# EAGLE design untitled (EAGLE 9.5.2)
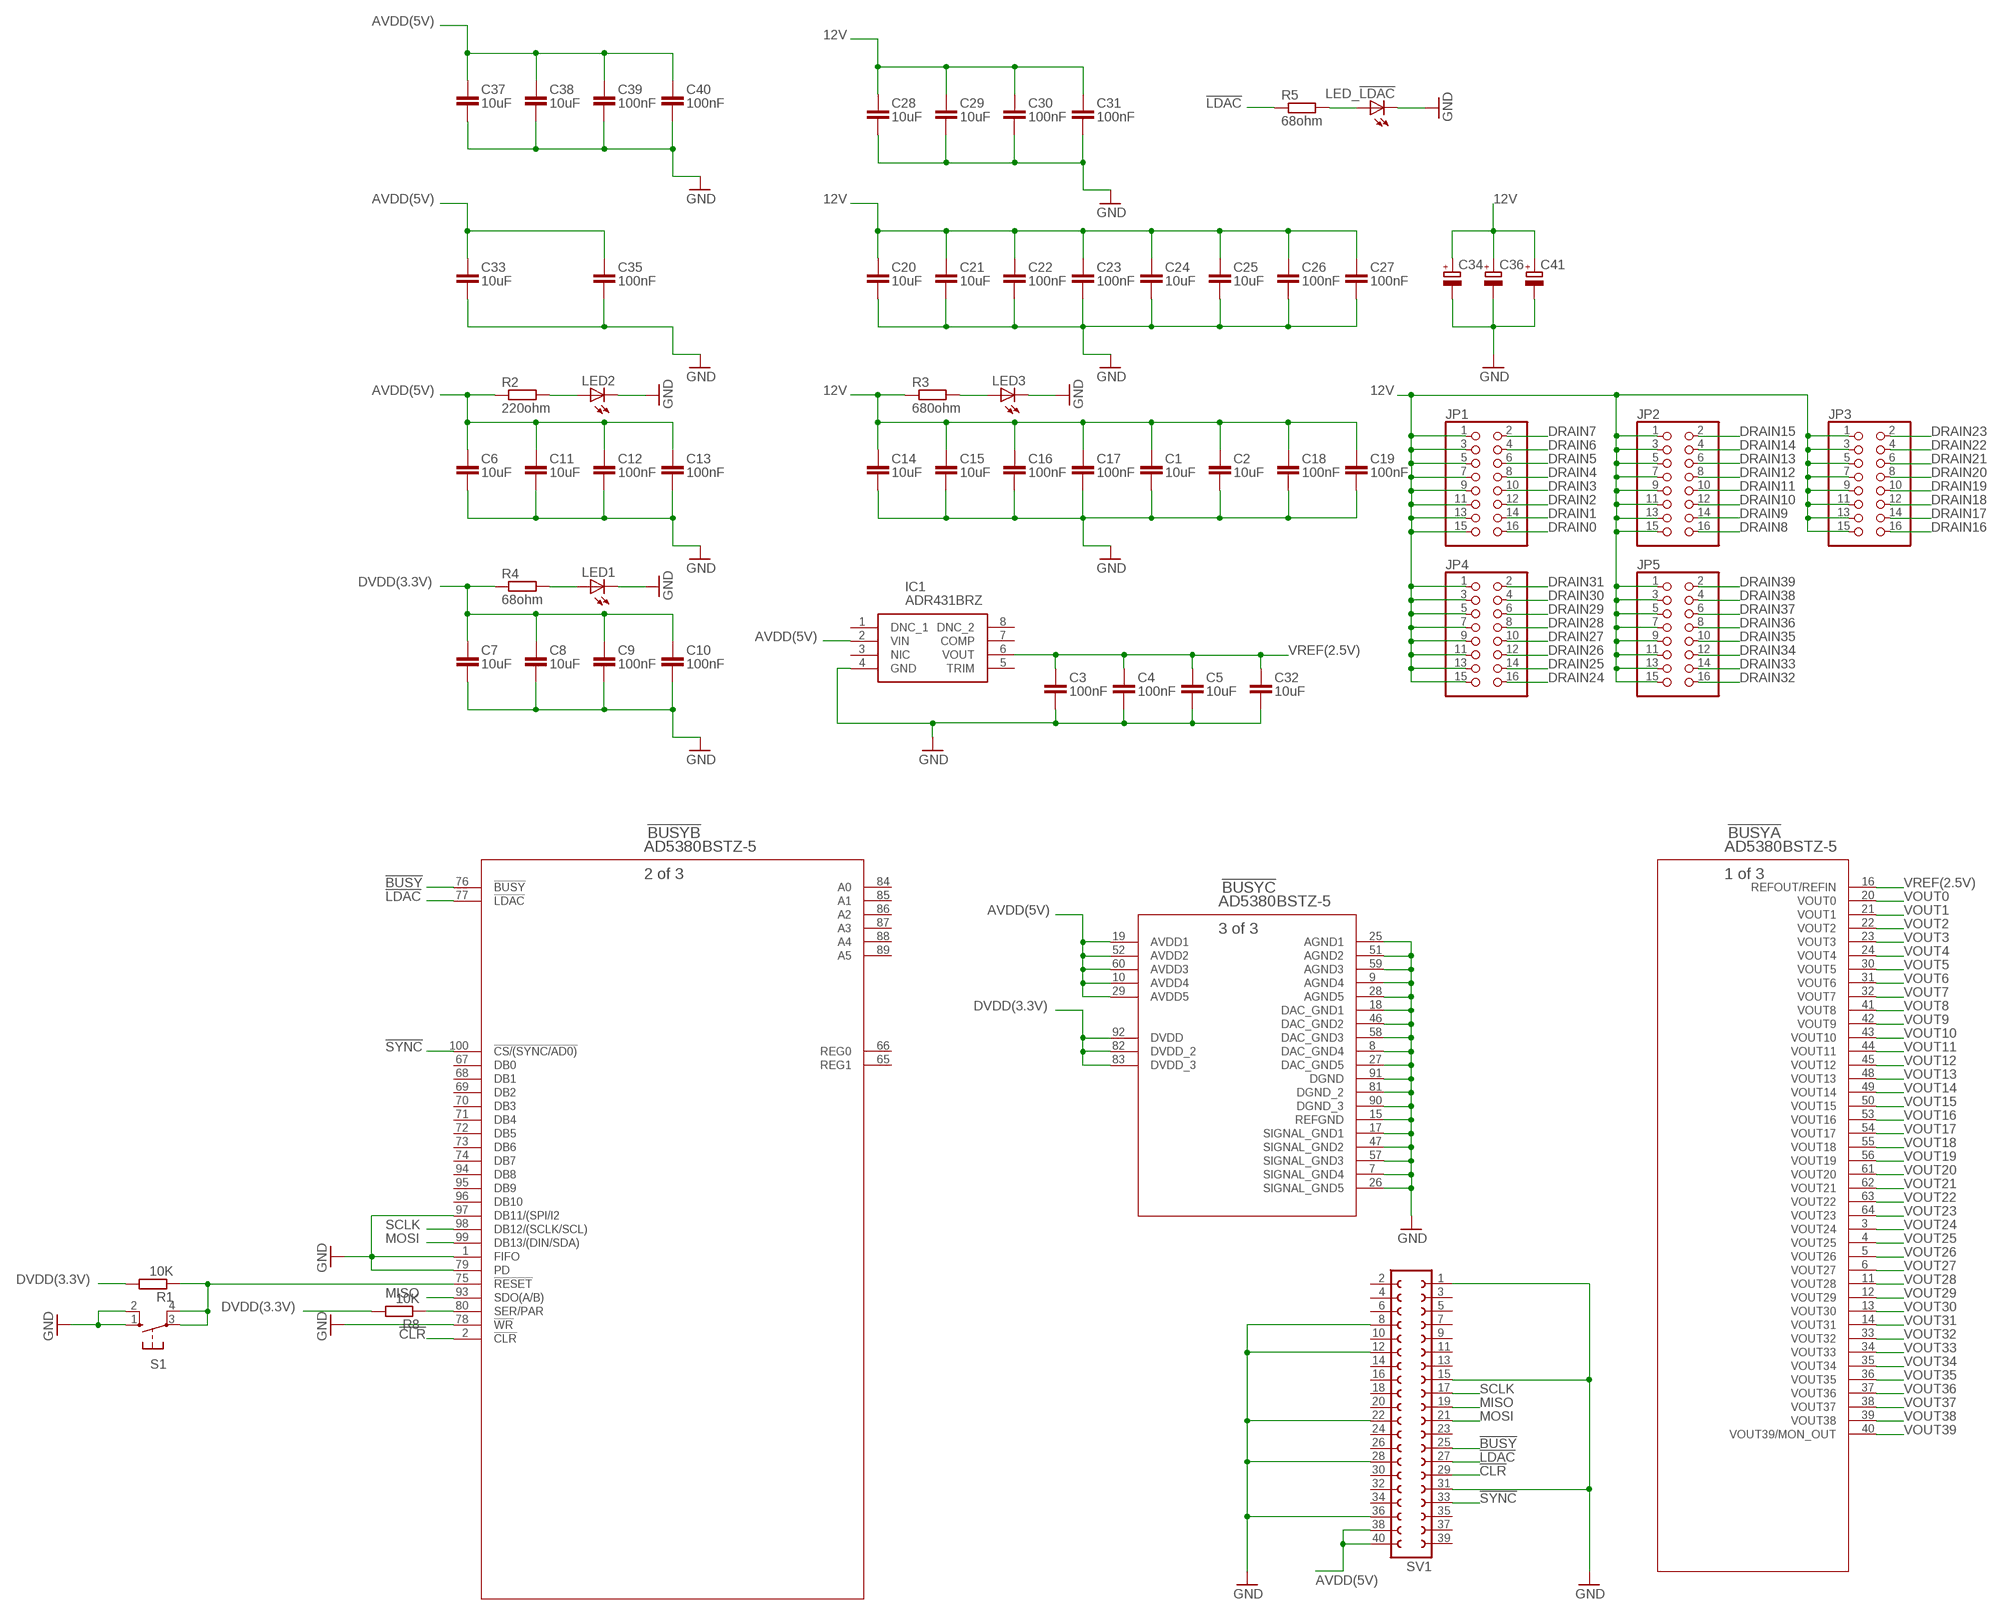
[diagram p0: schematic, sheet 1, part 1 of 2]
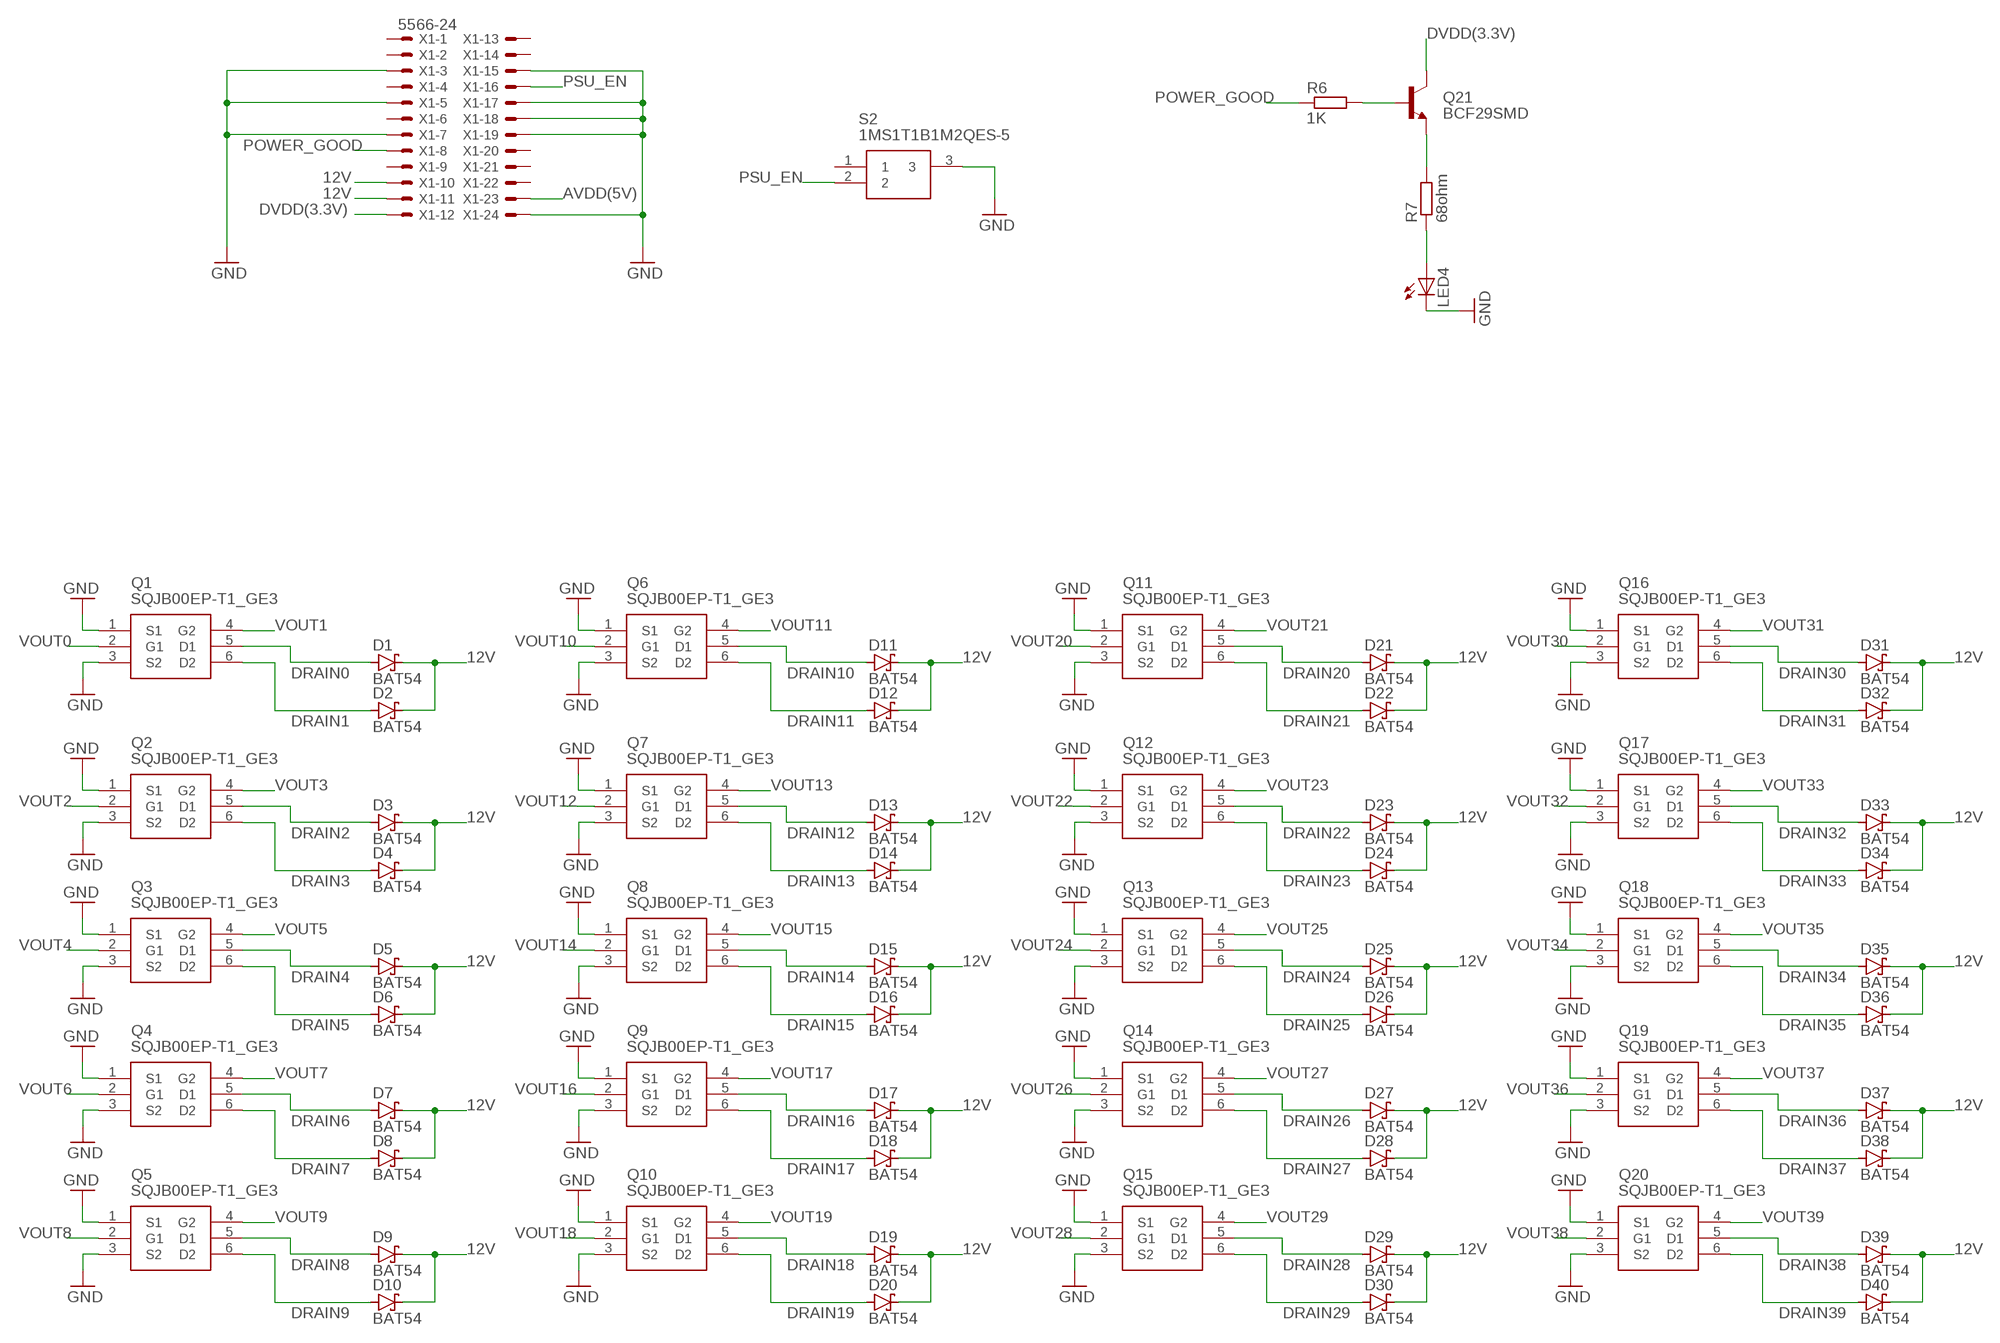
[diagram p1: schematic, sheet 1, part 2 of 2]

## Parts
!BUSY  AD5380BSTZ-5  [ST_100_1]
C1  10uF  C-EUC1206  [C1206]
C2  10uF  C-EUC1206  [C1206]
C3  100nF  C-EUC0603  [C0603]
C4  100nF  C-EUC0603  [C0603]
C5  10uF  C-EUC1206  [C1206]
C6  10uF  C-EUC1206  [C1206]
C7  10uF  C-EUC1206  [C1206]
C8  10uF  C-EUC1206  [C1206]
C9  100nF  C-EUC0603  [C0603]
C10  100nF  C-EUC0603  [C0603]
C11  10uF  C-EUC1206  [C1206]
C12  100nF  C-EUC0603  [C0603]
C13  100nF  C-EUC0603  [C0603]
C14  10uF  C-EUC1206  [C1206]
C15  10uF  C-EUC1206  [C1206]
C16  100nF  C-EUC0603  [C0603]
C17  100nF  C-EUC0603  [C0603]
C18  100nF  C-EUC0603  [C0603]
C19  100nF  C-EUC0603  [C0603]
C20  10uF  C-EUC1206  [C1206]
C21  10uF  C-EUC1206  [C1206]
C22  100nF  C-EUC0603  [C0603]
C23  100nF  C-EUC0603  [C0603]
C24  10uF  C-EUC1206  [C1206]
C25  10uF  C-EUC1206  [C1206]
C26  100nF  C-EUC0603  [C0603]
C27  100nF  C-EUC0603  [C0603]
C28  10uF  C-EUC1206  [C1206]
C29  10uF  C-EUC1206  [C1206]
C30  100nF  C-EUC0603  [C0603]
C31  100nF  C-EUC0603  [C0603]
C32  10uF  C-EUC1206  [C1206]
C33  10uF  C-EUC1206  [C1206]
C34  CPOL-EUE2-4  [E2-4]
C35  100nF  C-EUC0603  [C0603]
C36  CPOL-EUE2-4  [E2-4]
C37  10uF  C-EUC1206  [C1206]
C38  10uF  C-EUC1206  [C1206]
C39  100nF  C-EUC0603  [C0603]
C40  100nF  C-EUC0603  [C0603]
C41  CPOL-EUE3.5-10  [E3,5-10]
D1  BAT54  [SOT23]
D2  BAT54  [SOT23]
D3  BAT54  [SOT23]
D4  BAT54  [SOT23]
D5  BAT54  [SOT23]
D6  BAT54  [SOT23]
D7  BAT54  [SOT23]
D8  BAT54  [SOT23]
D9  BAT54  [SOT23]
D10  BAT54  [SOT23]
D11  BAT54  [SOT23]
D12  BAT54  [SOT23]
D13  BAT54  [SOT23]
D14  BAT54  [SOT23]
D15  BAT54  [SOT23]
D16  BAT54  [SOT23]
D17  BAT54  [SOT23]
D18  BAT54  [SOT23]
D19  BAT54  [SOT23]
D20  BAT54  [SOT23]
D21  BAT54  [SOT23]
D22  BAT54  [SOT23]
D23  BAT54  [SOT23]
D24  BAT54  [SOT23]
D25  BAT54  [SOT23]
D26  BAT54  [SOT23]
D27  BAT54  [SOT23]
D28  BAT54  [SOT23]
D29  BAT54  [SOT23]
D30  BAT54  [SOT23]
D31  BAT54  [SOT23]
D32  BAT54  [SOT23]
D33  BAT54  [SOT23]
D34  BAT54  [SOT23]
D35  BAT54  [SOT23]
D36  BAT54  [SOT23]
D37  BAT54  [SOT23]
D38  BAT54  [SOT23]
D39  BAT54  [SOT23]
D40  BAT54  [SOT23]
IC1  ADR431BRZ  [SOIC127P600X175-8N]
JP1  PINHD-2X8  [2X08]
JP2  PINHD-2X8  [2X08]
JP3  PINHD-2X8  [2X08]
JP4  PINHD-2X8  [2X08]
JP5  PINHD-2X8  [2X08]
LED1  LEDCHIPLED_0603  [CHIPLED_0603]
LED2  LEDCHIPLED_0603  [CHIPLED_0603]
LED3  LEDCHIPLED_0603  [CHIPLED_0603]
LED4  LEDCHIPLED_0603  [CHIPLED_0603]
LED_!LDAC  LEDCHIPLED_0603  [CHIPLED_0603]
Q1  SQJB00EP-T1_GE3  [SQJ968EPT1GE3]
Q2  SQJB00EP-T1_GE3  [SQJ968EPT1GE3]
Q3  SQJB00EP-T1_GE3  [SQJ968EPT1GE3]
Q4  SQJB00EP-T1_GE3  [SQJ968EPT1GE3]
Q5  SQJB00EP-T1_GE3  [SQJ968EPT1GE3]
Q6  SQJB00EP-T1_GE3  [SQJ968EPT1GE3]
Q7  SQJB00EP-T1_GE3  [SQJ968EPT1GE3]
Q8  SQJB00EP-T1_GE3  [SQJ968EPT1GE3]
Q9  SQJB00EP-T1_GE3  [SQJ968EPT1GE3]
Q10  SQJB00EP-T1_GE3  [SQJ968EPT1GE3]
Q11  SQJB00EP-T1_GE3  [SQJ968EPT1GE3]
Q12  SQJB00EP-T1_GE3  [SQJ968EPT1GE3]
Q13  SQJB00EP-T1_GE3  [SQJ968EPT1GE3]
Q14  SQJB00EP-T1_GE3  [SQJ968EPT1GE3]
Q15  SQJB00EP-T1_GE3  [SQJ968EPT1GE3]
Q16  SQJB00EP-T1_GE3  [SQJ968EPT1GE3]
Q17  SQJB00EP-T1_GE3  [SQJ968EPT1GE3]
Q18  SQJB00EP-T1_GE3  [SQJ968EPT1GE3]
Q19  SQJB00EP-T1_GE3  [SQJ968EPT1GE3]
Q20  SQJB00EP-T1_GE3  [SQJ968EPT1GE3]
Q21  BCF29SMD  [SOT23-BEC]
R1  10K  R-EU_R0603  [R0603]
R2  220ohm  R-EU_R0805  [R0805]
R3  680ohm  R-EU_R0805  [R0805]
R4  68ohm  R-EU_R0805  [R0805]
R5  68ohm  R-EU_R0805  [R0805]
R6  1K  R-EU_R0805  [R0805]
R7  68ohm  R-EU_R0805  [R0805]
R8  10K  R-EU_R0603  [R0603]
S1  10-XX  [B3F-10XX]
S2  1MS1T1B1M2QES-5  [1MS1T1B1M2QES-5]
SV1  FE20-2  [FE20-2]
X1  5566-24  [5566-24]

## Nets
12V: C1.1 C2.1 C14.1 C15.1 C16.1 C17.1 C18.1 C19.1 C20.1 C21.1 C22.1 C23.1 C24.1 C25.1 C26.1 C27.1 C28.1 C29.1 C30.1 C31.1 C34.+ C36.+ C41.+ D1.3(C) D2.3(C) D3.3(C) D4.3(C) D5.3(C) D6.3(C) D7.3(C) D8.3(C) D9.3(C) D10.3(C) D11.3(C) D12.3(C) D13.3(C) D14.3(C) D15.3(C) D16.3(C) D17.3(C) D18.3(C) D19.3(C) D20.3(C) D21.3(C) D22.3(C) D23.3(C) D24.3(C) D25.3(C) D26.3(C) D27.3(C) D28.3(C) D29.3(C) D30.3(C) D31.3(C) D32.3(C) D33.3(C) D34.3(C) D35.3(C) D36.3(C) D37.3(C) D38.3(C) D39.3(C) D40.3(C) JP1.1 JP1.3 JP1.5 JP1.7 JP1.9 JP1.11 JP1.13 JP1.15 JP2.1 JP2.3 JP2.5 JP2.7 JP2.9 JP2.11 JP2.13 JP2.15 JP3.1 JP3.3 JP3.5 JP3.7 JP3.9 JP3.11 JP3.13 JP3.15 JP4.1 JP4.3 JP4.5 JP4.7 JP4.9 JP4.11 JP4.13 JP4.15 JP5.1 JP5.3 JP5.5 JP5.7 JP5.9 JP5.11 JP5.13 JP5.15 R3.1 X1.10 X1.11
!BUSY: !BUSY.76(B:!BUSY) SV1.25
!CLR: !BUSY.2(B:!CLR) SV1.29
!LDAC: !BUSY.77(B:!LDAC) R5.1 SV1.27
!RESET: !BUSY.75(B:!RESET) R1.1 S1.3(P) S1.4(P1)
!SYNC: !BUSY.100(B:!CS/(SYNC/AD0)) SV1.33
AVDD(5V): !BUSY.10(C:AVDD4) !BUSY.19(C:AVDD1) !BUSY.29(C:AVDD5) !BUSY.52(C:AVDD2) !BUSY.60(C:AVDD3) C6.1 C11.1 C12.1 C13.1 C33.1 C35.1 C37.1 C38.1 C39.1 C40.1 IC1.2(VIN) R2.1 SV1.38 SV1.40 X1.23
DRAIN0: D1.1(A) JP1.16 Q1.5(D1)
DRAIN1: D2.1(A) JP1.14 Q1.6(D2)
DRAIN2: D3.1(A) JP1.12 Q2.5(D1)
DRAIN3: D4.1(A) JP1.10 Q2.6(D2)
DRAIN4: D5.1(A) JP1.8 Q3.5(D1)
DRAIN5: D6.1(A) JP1.6 Q3.6(D2)
DRAIN6: D7.1(A) JP1.4 Q4.5(D1)
DRAIN7: D8.1(A) JP1.2 Q4.6(D2)
DRAIN8: D9.1(A) JP2.16 Q5.5(D1)
DRAIN9: D10.1(A) JP2.14 Q5.6(D2)
DRAIN10: D11.1(A) JP2.12 Q6.5(D1)
DRAIN11: D12.1(A) JP2.10 Q6.6(D2)
DRAIN12: D13.1(A) JP2.8 Q7.5(D1)
DRAIN13: D14.1(A) JP2.6 Q7.6(D2)
DRAIN14: D15.1(A) JP2.4 Q8.5(D1)
DRAIN15: D16.1(A) JP2.2 Q8.6(D2)
DRAIN16: D17.1(A) JP3.16 Q9.5(D1)
DRAIN17: D18.1(A) JP3.14 Q9.6(D2)
DRAIN18: D19.1(A) JP3.12 Q10.5(D1)
DRAIN19: D20.1(A) JP3.10 Q10.6(D2)
DRAIN20: D21.1(A) JP3.8 Q11.5(D1)
DRAIN21: D22.1(A) JP3.6 Q11.6(D2)
DRAIN22: D23.1(A) JP3.4 Q12.5(D1)
DRAIN23: D24.1(A) JP3.2 Q12.6(D2)
DRAIN24: D25.1(A) JP4.16 Q13.5(D1)
DRAIN25: D26.1(A) JP4.14 Q13.6(D2)
DRAIN26: D27.1(A) JP4.12 Q14.5(D1)
DRAIN27: D28.1(A) JP4.10 Q14.6(D2)
DRAIN28: D29.1(A) JP4.8 Q15.5(D1)
DRAIN29: D30.1(A) JP4.6 Q15.6(D2)
DRAIN30: D31.1(A) JP4.4 Q16.5(D1)
DRAIN31: D32.1(A) JP4.2 Q16.6(D2)
DRAIN32: D33.1(A) JP5.16 Q17.5(D1)
DRAIN33: D34.1(A) JP5.14 Q17.6(D2)
DRAIN34: D35.1(A) JP5.12 Q18.5(D1)
DRAIN35: D36.1(A) JP5.10 Q18.6(D2)
DRAIN36: D37.1(A) JP5.8 Q19.5(D1)
DRAIN37: D38.1(A) JP5.6 Q19.6(D2)
DRAIN38: D39.1(A) JP5.4 Q20.5(D1)
DRAIN39: D40.1(A) JP5.2 Q20.6(D2)
DVDD(3.3V): !BUSY.82(C:DVDD_2) !BUSY.83(C:DVDD_3) !BUSY.92(C:DVDD) C7.1 C8.1 C9.1 C10.1 Q21.C R1.2 R4.1 R8.2 X1.12
GND: !BUSY.1(B:FIFO) !BUSY.7(C:SIGNAL_GND4) !BUSY.8(C:DAC_GND4) !BUSY.9(C:AGND4) !BUSY.15(C:REFGND) !BUSY.17(C:SIGNAL_GND1) !BUSY.18(C:DAC_GND1) !BUSY.25(C:AGND1) !BUSY.26(C:SIGNAL_GND5) !BUSY.27(C:DAC_GND5) !BUSY.28(C:AGND5) !BUSY.46(C:DAC_GND2) !BUSY.47(C:SIGNAL_GND2) !BUSY.51(C:AGND2) !BUSY.57(C:SIGNAL_GND3) !BUSY.58(C:DAC_GND3) !BUSY.59(C:AGND3) !BUSY.78(B:!WR) !BUSY.79(B:PD) !BUSY.81(C:DGND_2) !BUSY.90(C:DGND_3) !BUSY.91(C:DGND) !BUSY.97(B:DB11/(SPI/I2) C1.2 C2.2 C3.2 C4.2 C5.2 C6.2 C7.2 C8.2 C9.2 C10.2 C11.2 C12.2 C13.2 C14.2 C15.2 C16.2 C17.2 C18.2 C19.2 C20.2 C21.2 C22.2 C23.2 C24.2 C25.2 C26.2 C27.2 C28.2 C29.2 C30.2 C31.2 C32.2 C33.2 C34.- C35.2 C36.- C37.2 C38.2 C39.2 C40.2 C41.- IC1.4(GND) LED1.C LED2.C LED3.C LED4.C LED_!LDAC.C Q1.1(S1) Q1.3(S2) Q2.1(S1) Q2.3(S2) Q3.1(S1) Q3.3(S2) Q4.1(S1) Q4.3(S2) Q5.1(S1) Q5.3(S2) Q6.1(S1) Q6.3(S2) Q7.1(S1) Q7.3(S2) Q8.1(S1) Q8.3(S2) Q9.1(S1) Q9.3(S2) Q10.1(S1) Q10.3(S2) Q11.1(S1) Q11.3(S2) Q12.1(S1) Q12.3(S2) Q13.1(S1) Q13.3(S2) Q14.1(S1) Q14.3(S2) Q15.1(S1) Q15.3(S2) Q16.1(S1) Q16.3(S2) Q17.1(S1) Q17.3(S2) Q18.1(S1) Q18.3(S2) Q19.1(S1) Q19.3(S2) Q20.1(S1) Q20.3(S2) S1.1(S) S1.2(S1) S2.3 SV1.1 SV1.8 SV1.12 SV1.15 SV1.22 SV1.28 SV1.31 SV1.36 X1.3 X1.5 X1.7 X1.15 X1.17 X1.18 X1.19 X1.24
MISO: !BUSY.93(B:SDO(A/B)) SV1.19
MOSI: !BUSY.99(B:DB13/(DIN/SDA)) SV1.21
N$1: LED2.A R2.2
N$3: LED1.A R4.2
N$4: LED3.A R3.2
N$5: LED_!LDAC.A R5.2
N$6: Q21.B R6.2
N$7: Q21.E R7.2
N$8: LED4.A R7.1
POWER_GOOD: R6.1 X1.8
PSU_EN: S2.2 X1.16
SCLK: !BUSY.98(B:DB12/(SCLK/SCL)) SV1.17
SER/PAR: !BUSY.80(B:SER/PAR) R8.1
VOUT0: !BUSY.20(A:VOUT0) Q1.2(G1)
VOUT1: !BUSY.21(A:VOUT1) Q1.4(G2)
VOUT2: !BUSY.22(A:VOUT2) Q2.2(G1)
VOUT3: !BUSY.23(A:VOUT3) Q2.4(G2)
VOUT4: !BUSY.24(A:VOUT4) Q3.2(G1)
VOUT5: !BUSY.30(A:VOUT5) Q3.4(G2)
VOUT6: !BUSY.31(A:VOUT6) Q4.2(G1)
VOUT7: !BUSY.32(A:VOUT7) Q4.4(G2)
VOUT8: !BUSY.41(A:VOUT8) Q5.2(G1)
VOUT9: !BUSY.42(A:VOUT9) Q5.4(G2)
VOUT10: !BUSY.43(A:VOUT10) Q6.2(G1)
VOUT11: !BUSY.44(A:VOUT11) Q6.4(G2)
VOUT12: !BUSY.45(A:VOUT12) Q7.2(G1)
VOUT13: !BUSY.48(A:VOUT13) Q7.4(G2)
VOUT14: !BUSY.49(A:VOUT14) Q8.2(G1)
VOUT15: !BUSY.50(A:VOUT15) Q8.4(G2)
VOUT16: !BUSY.53(A:VOUT16) Q9.2(G1)
VOUT17: !BUSY.54(A:VOUT17) Q9.4(G2)
VOUT18: !BUSY.55(A:VOUT18) Q10.2(G1)
VOUT19: !BUSY.56(A:VOUT19) Q10.4(G2)
VOUT20: !BUSY.61(A:VOUT20) Q11.2(G1)
VOUT21: !BUSY.62(A:VOUT21) Q11.4(G2)
VOUT22: !BUSY.63(A:VOUT22) Q12.2(G1)
VOUT23: !BUSY.64(A:VOUT23) Q12.4(G2)
VOUT24: !BUSY.3(A:VOUT24) Q13.2(G1)
VOUT25: !BUSY.4(A:VOUT25) Q13.4(G2)
VOUT26: !BUSY.5(A:VOUT26) Q14.2(G1)
VOUT27: !BUSY.6(A:VOUT27) Q14.4(G2)
VOUT28: !BUSY.11(A:VOUT28) Q15.2(G1)
VOUT29: !BUSY.12(A:VOUT29) Q15.4(G2)
VOUT30: !BUSY.13(A:VOUT30) Q16.2(G1)
VOUT31: !BUSY.14(A:VOUT31) Q16.4(G2)
VOUT32: !BUSY.33(A:VOUT32) Q17.2(G1)
VOUT33: !BUSY.34(A:VOUT33) Q17.4(G2)
VOUT34: !BUSY.35(A:VOUT34) Q18.2(G1)
VOUT35: !BUSY.36(A:VOUT35) Q18.4(G2)
VOUT36: !BUSY.37(A:VOUT36) Q19.2(G1)
VOUT37: !BUSY.38(A:VOUT37) Q19.4(G2)
VOUT38: !BUSY.39(A:VOUT38) Q20.2(G1)
VOUT39: !BUSY.40(A:VOUT39/MON_OUT) Q20.4(G2)
VREF(2.5V): !BUSY.16(A:REFOUT/REFIN) C3.1 C4.1 C5.1 C32.1 IC1.6(VOUT)
Unconnected: !BUSY.65(B:REG1) !BUSY.66(B:REG0) !BUSY.67(B:DB0) !BUSY.68(B:DB1) !BUSY.69(B:DB2) !BUSY.70(B:DB3) !BUSY.71(B:DB4) !BUSY.72(B:DB5) !BUSY.73(B:DB6) !BUSY.74(B:DB7) !BUSY.84(B:A0) !BUSY.85(B:A1) !BUSY.86(B:A2) !BUSY.87(B:A3) !BUSY.88(B:A4) !BUSY.89(B:A5) !BUSY.94(B:DB8) !BUSY.95(B:DB9) !BUSY.96(B:DB10) IC1.1(DNC_1) IC1.3(NIC) IC1.5(TRIM) IC1.7(COMP) IC1.8(DNC_2) S2.1 SV1.2 SV1.3 SV1.4 SV1.5 SV1.6 SV1.7 SV1.9 SV1.10 SV1.11 SV1.13 SV1.14 SV1.16 SV1.18 SV1.20 SV1.23 SV1.24 SV1.26 SV1.30 SV1.32 SV1.34 SV1.35 SV1.37 SV1.39 X1.1 X1.2 X1.4 X1.6 X1.9 X1.13 X1.14 X1.20 X1.21 X1.22

## Library data of the parts
!BUSY = AD5380:AD5380BSTZ-5; MANUFACTURER_PART_NUMBER: AD5380BSTZ5; VENDOR: Analog Devices Inc
C1-C33 C35 C37-C40 = rcl:C-EU: CAPACITOR, European symbol; SPICEPREFIX: C
C34 C36 C41 = rcl:CPOL-EU: POLARIZED CAPACITOR, European symbol; SPICEPREFIX: C
D1-D40 = diode:BAT54: Schottky Diodes Source: Fairchild .. BAT54.pdf
IC1 = ADR431BRZ:ADR431BRZ: ADR431BRZ, Precision Voltage Reference 2.499 to 2.501V, 0.04% 30mA 20V max. 8-Pin SOIC Source: Datasheet <http://www.analog.com/static/imported-files/data_sheets/ADR430_431_433_434_435.pdf>; DESCRIPTION: ADR431BRZ, Precision Voltage Reference 2.499 to 2.501V, 0.04% 30mA 20V max. 8-Pin SOIC; HEIGHT: 1.75mm; MANUFACTURER_NAME: Analog Devices; MANUFACTURER_PART_NUMBER: ADR431BRZ; MOUSER_PART_NUMBER: 584-ADR431BRZ; MOUSER_PRICE-STOCK: https://www.mouser.com/Search/Refine.aspx?Keyword=584-ADR431BRZ; RS_PART_NUMBER: 6977745P; RS_PRICE-STOCK: http://uk.rs-online.com/web/p/products/6977745P
JP1-JP5 = pinhead:PINHD-2X8: PIN HEADER
LED1-LED4 LED_!LDAC = adafruit:LED: LED OSRAM: - CHIPLED LG R971, LG N971, LY N971, LG Q971, LY Q971, LO R971, LY R971 LH N974, LH R974 LS Q976, LO Q976, LY Q976 LO Q996 - Hyper CHIPLED LW Q18S LB Q993, LB Q99A, LB R99A - SideLED LS A670, LO A670, LY A670, LG A670, LP A670 LB A673, LV A673, LT A673, LW A673 LH A674 LY A675 LS A676, LA A676, LO A676, LY A676, LW A676 LS A679, LY A679, LG A679 - Hyper Micro SIDELED® LS Y876, LA Y876, LO Y876, LY Y876 LT Y87S - SmartLED LW L88C, LW L88S LB L89C, LB L89S, LG L890 LS L89K, LO L89K, LY L89K LS L896, LA L896, LO L896, LY L896 - TOPLED LS T670, LO T670, LY T670, LG T670, LP T670 LSG T670, LSP T670, LSY T670, LOP T670, LYG T670 LG T671, LOG T671, LSG T671 LB T673, LV T673, LT T673, LW T673 LH T674 LS T676, LA T676, LO T676, LY T676, LB T676, LH T676, LSB T676, LW T676 LB T67C, LV T67C, LT T67C, LS T67K, LO T67K, LY T67K, LW E67C LS E67B, LA E67B, LO E67B, LY E67B, LB E67C, LV E67C, LT E67C LW T67C LS T679, LY T679, LG T679 LS T770, LO T770, LY T770, LG T770, LP T770 LB T773, LV T773, LT T773, LW T773 LH T774 LS E675, LA E675, LY E675, LS T675 LS T776, LA T776, LO T776, LY T776, LB T776 LHGB T686 LT T68C, LB T68C - Hyper Mini TOPLED® LB M676 - Mini TOPLED Santana® LG M470 LS M47K, LO M47K, LY M47K Source: http://www.osram.convergy.de/
Q1-Q20 = SQJB00EP-T1_GE3:SQJB00EP-T1_GE3: MOSFET N-Ch 60V Vds AEC-Q101 Qualified Source: Datasheet <https://componentsearchengine.com/Datasheets/1/SQJB00EP-T1_GE3.pdf>; DESCRIPTION: MOSFET N-Ch 60V Vds AEC-Q101 Qualified; HEIGHT: mm; MANUFACTURER_NAME: Vishay; MANUFACTURER_PART_NUMBER: SQJB00EP-T1_GE3; MOUSER_PART_NUMBER: 78-SQJB00EP-T1_GE3; MOUSER_PRICE-STOCK: https://www.mouser.com/Search/Refine.aspx?Keyword=78-SQJB00EP-T1_GE3
Q21 = transistor-npn:BCF29*: NPN Transistor
R1-R8 = rcl:R-EU_: RESISTOR, European symbol; SPICEPREFIX: R
S1 = switch-omron:10-XX: OMRON SWITCH; MPN: B3F-1000; OC_FARNELL: 176432; OC_NEWARK: 36M3542
S2 = 1MS1T1B1M2QES-5:1MS1T1B1M2QES-5: Toggle switch,SP,on-none-on,PC thru-hole Toggle Switch SPDT On-On, 5 A @ 250 V ac, PCB Source: Datasheet <http://uk.rs-online.com/web/p/products/7347066>; DESCRIPTION: Toggle switch,SP,on-none-on,PC thru-hole Toggle Switch SPDT On-On, 5 A @ 250 V ac, PCB; HEIGHT: mm; MANUFACTURER_NAME: RS Components; MANUFACTURER_PART_NUMBER: 1MS1T1B1M2QES-5; RS_PART_NUMBER: 7347066; RS_PRICE-STOCK: https://uk.rs-online.com/web/p/products/7347066
SV1 = con-lsta:FE20-2: FEMALE HEADER; OC_FARNELL: unknown; OC_NEWARK: unknown
X1 = con-molex:5566-24: Mini FIT connector 24 pol Source: http://www.molex.com; MF: MOLEX; OC_FARNELL: unknown; OC_NEWARK: unknown

## Net classes
0 default: width 0.254 mm, clearance 0.178 mm

## Board
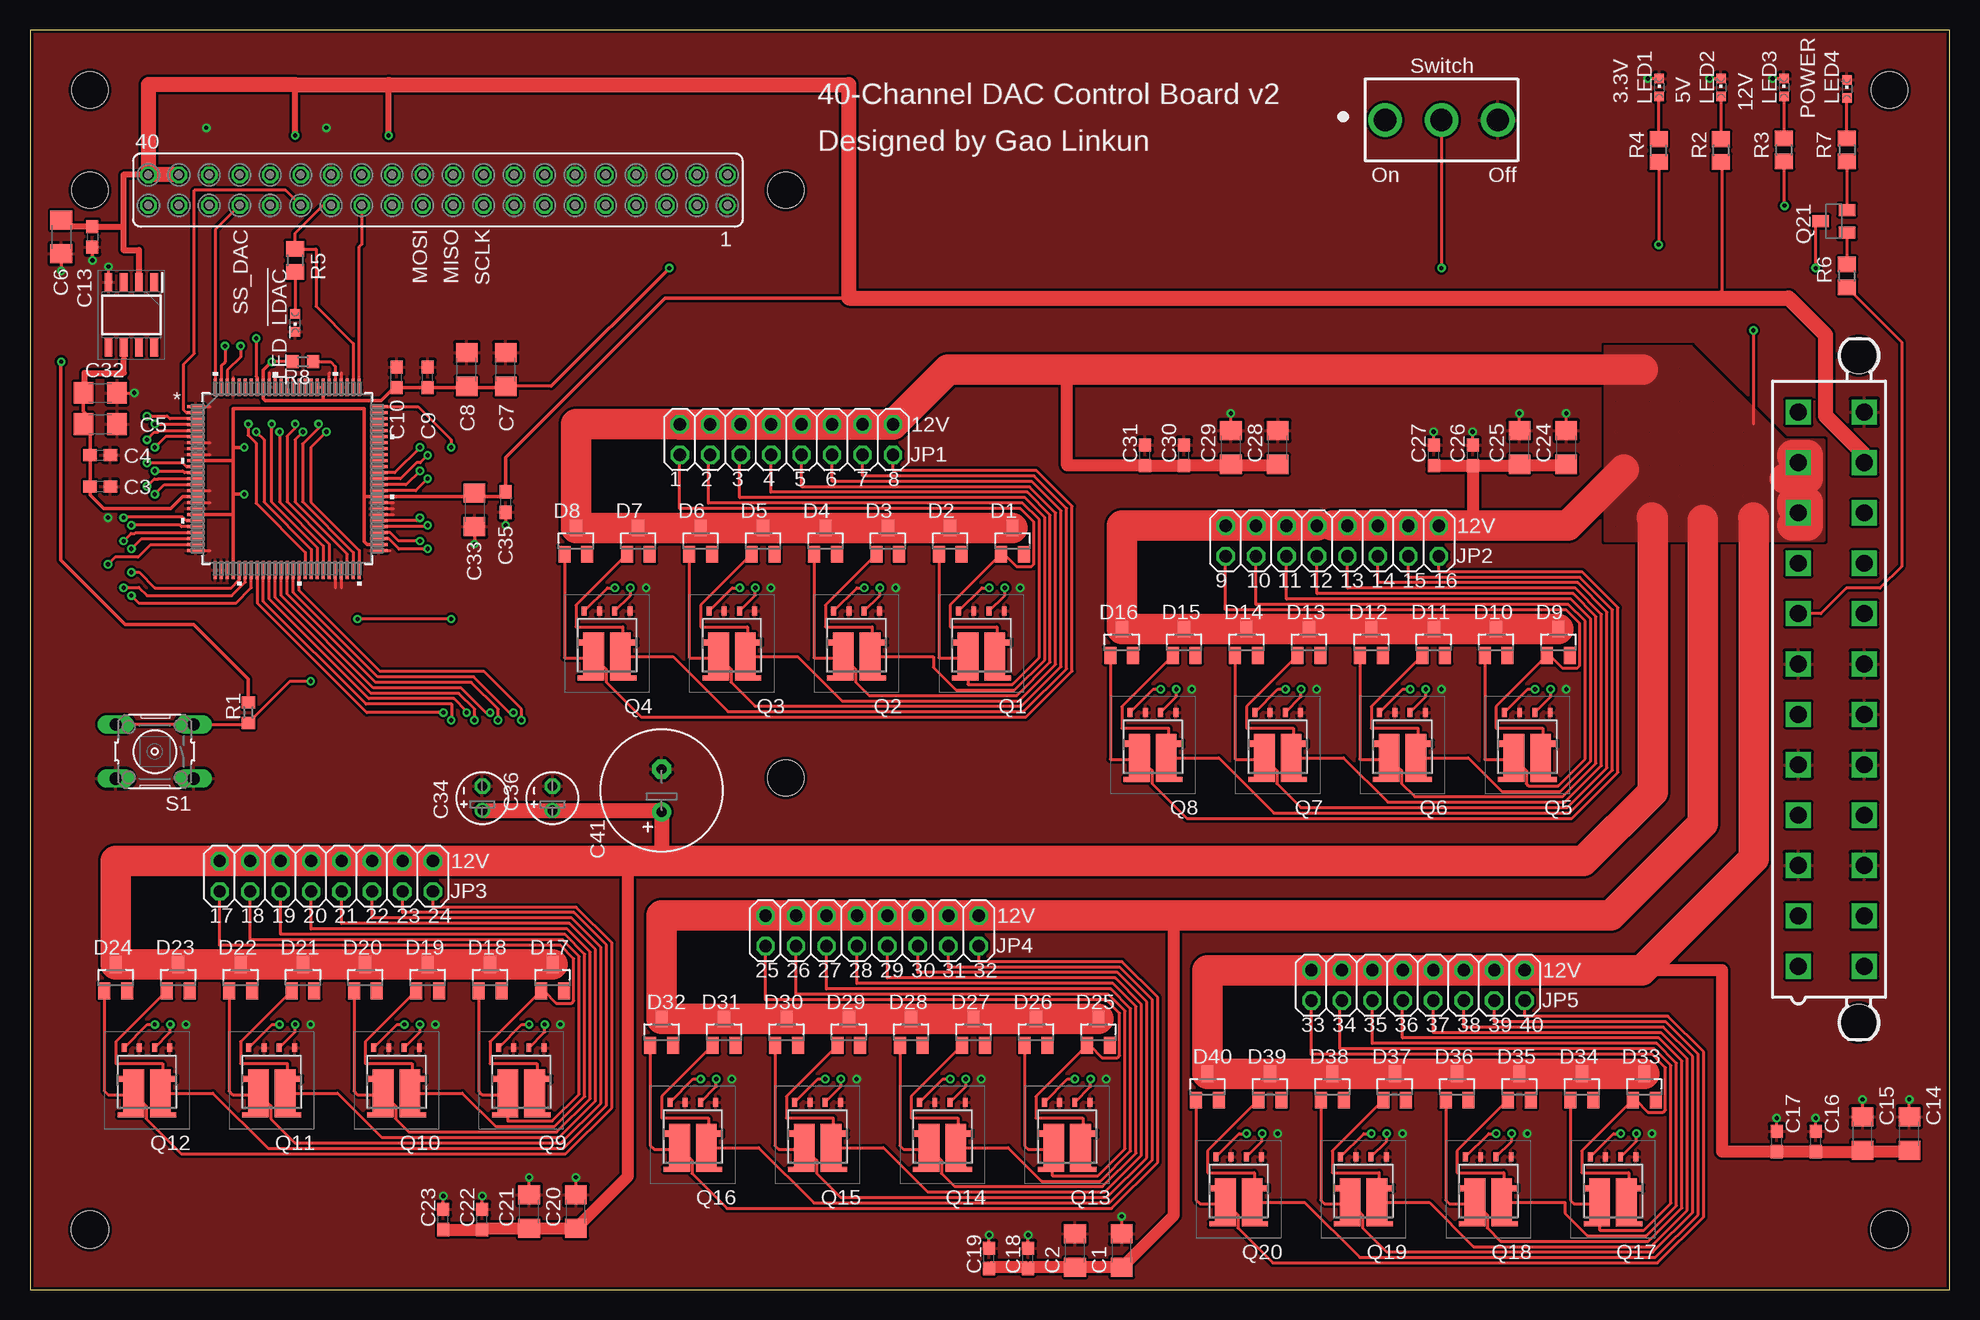
[diagram p2: board, top side]
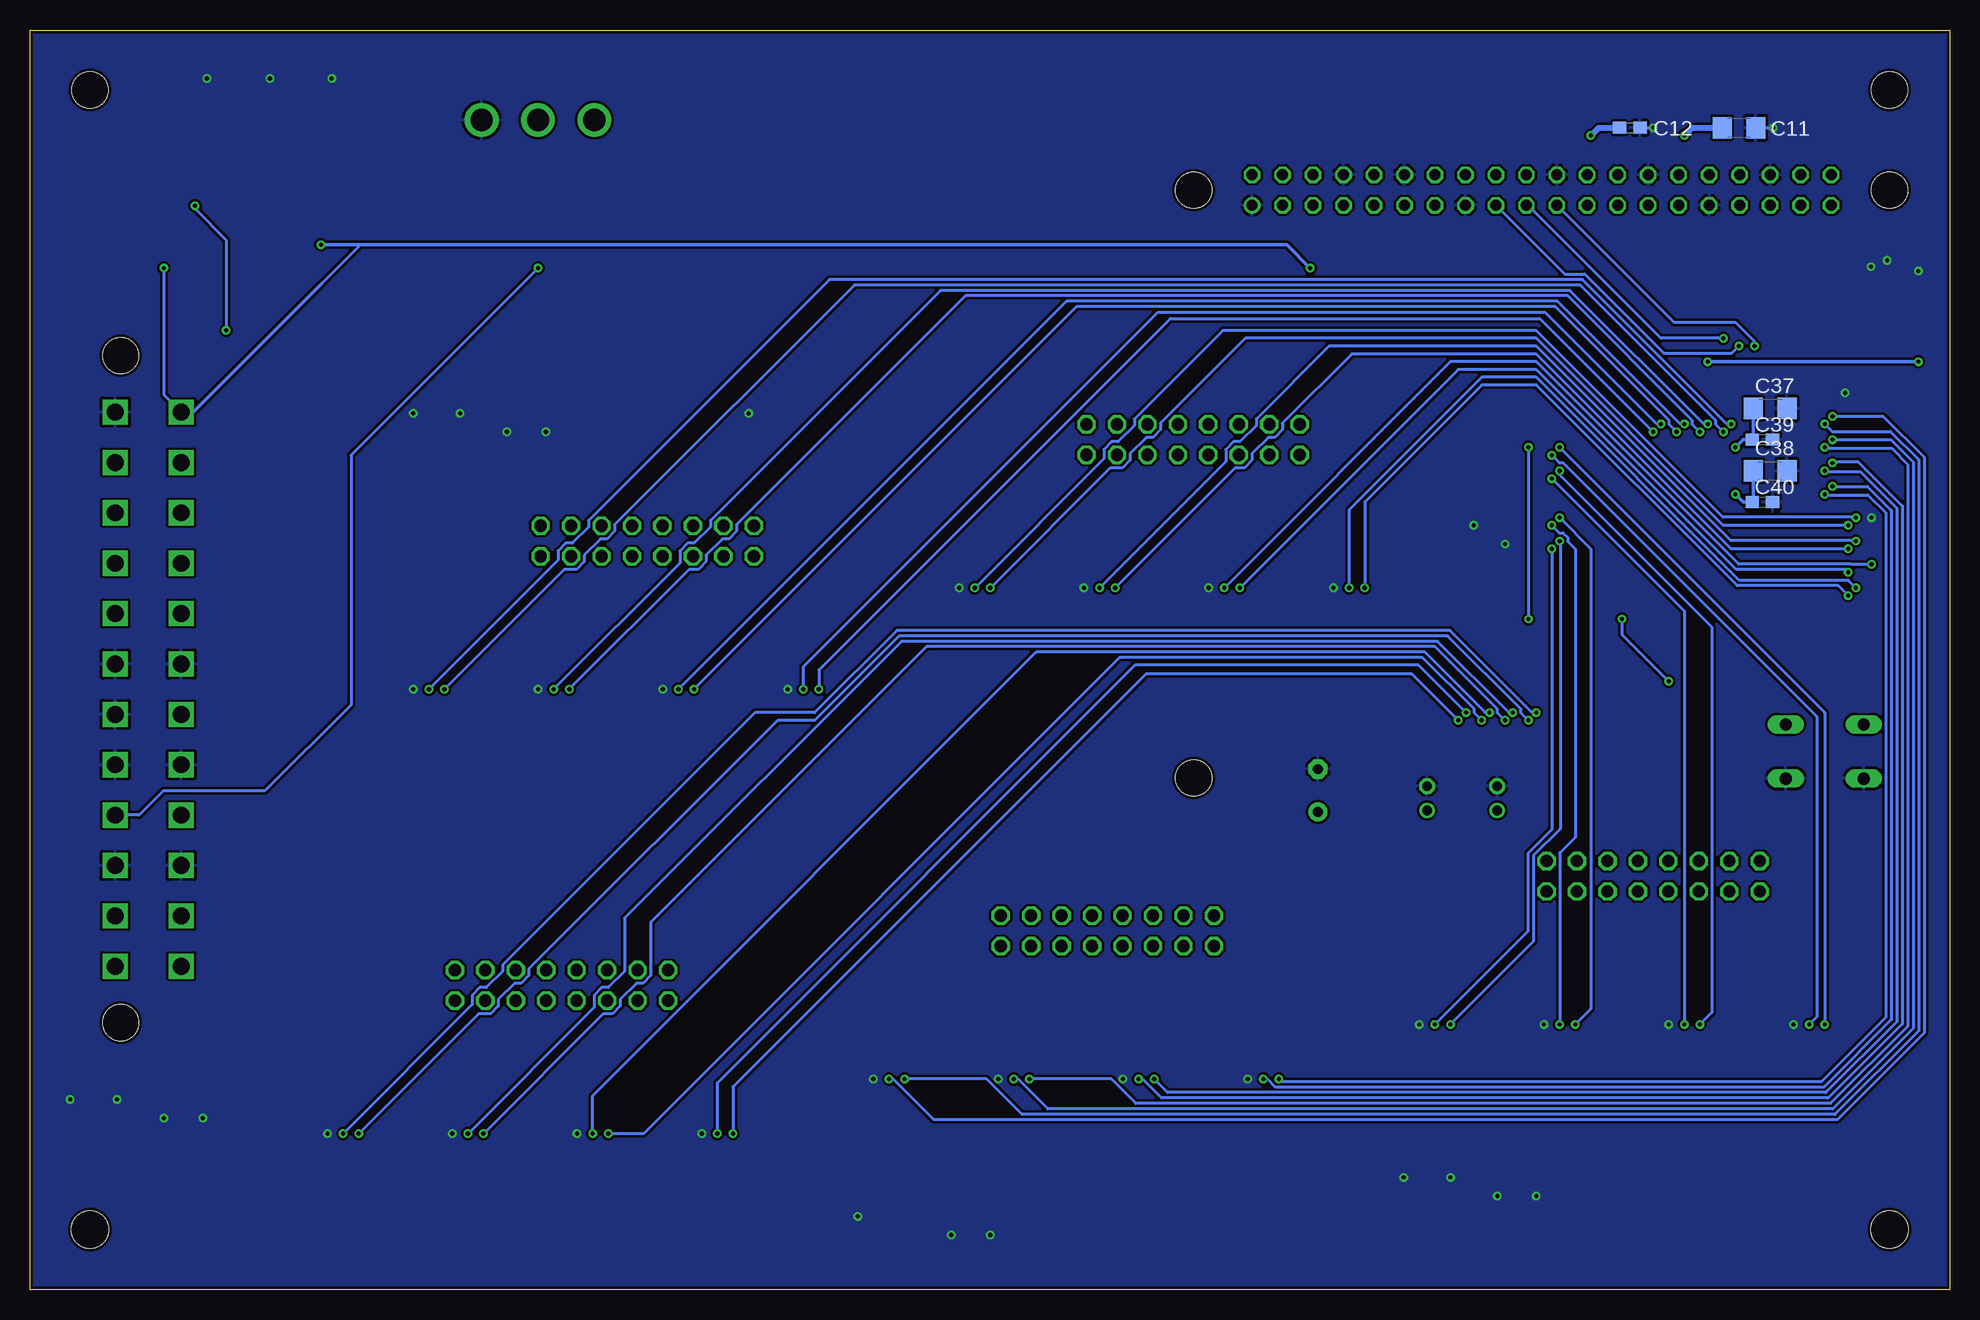
[diagram p3: board, bottom side, seen from below]

Size 160 x 105 mm. Coordinates in mm from the lower left corner, seen from the top.
Outline: 0,0 160,0 160,105 0,105 0,0
Copper layers (1+2*15+16): Top 0.035mm / dielectric 1.5mm / Route2 0.0175mm / dielectric 1.1mm / Route15 0.0175mm / dielectric 0.2mm / Bottom 0.035mm
Design rules "dirt_cheap_dirty_boards.v1.1": minimum track width 6mil, minimum drill 12mil, track to track 0.2mm, track to pad 0.2mm, pad to pad 0.2mm, via to via 0.2mm, smd to smd 0mil, copper to edge 10mil, drill to drill 10mil, minimum pad ring 7mil, minimum via ring 0.175mm, stop-mask expansion 2mil, vias tented up to drill 25mil, thermal gap 10mil
Holes 3.1 mm at 155,5 5,5
Holes 3 mm at 155,100 5,100 5,91.65 63,91.65 63,42.65

### Footprints (pad centres in the part's own frame; a part is rotated, then mirrored left to right if it is on the bottom)
ST_100_1 = smd 1.462 x 0.239: 1 -7.62,6; 2 -7.62,5.5; 3 -7.62,5; 4 -7.62,4.5; 5 -7.62,4; 6 -7.62,3.5; 7 -7.62,3; 8 -7.62,2.5; 9 -7.62,2; 10 -7.62,1.5; 11 -7.62,1; 12 -7.62,0.5; 13 -7.62,0; 14 -7.62,-0.5; 15 -7.62,-1; 16 -7.62,-1.5; 17 -7.62,-2; 18 -7.62,-2.5; 19 -7.62,-3; 20 -7.62,-3.5; 21 -7.62,-4; 22 -7.62,-4.5; 23 -7.62,-5; 24 -7.62,-5.5; 25 -7.62,-6; 51 7.62,-6; 52 7.62,-5.5; 53 7.62,-5; 54 7.62,-4.5; 55 7.62,-4; 56 7.62,-3.5; 57 7.62,-3; 58 7.62,-2.5; 59 7.62,-2; 60 7.62,-1.5; 61 7.62,-1; 62 7.62,-0.5; 63 7.62,0; 64 7.62,0.5; 65 7.62,1; 66 7.62,1.5; 67 7.62,2; 68 7.62,2.5; 69 7.62,3; 70 7.62,3.5; 71 7.62,4; 72 7.62,4.5; 73 7.62,5; 74 7.62,5.5; 75 7.62,6 | smd 0.239 x 1.462: 26 -6,-7.62; 27 -5.5,-7.62; 28 -5,-7.62; 29 -4.5,-7.62; 30 -4,-7.62; 31 -3.5,-7.62; 32 -3,-7.62; 33 -2.5,-7.62; 34 -2,-7.62; 35 -1.5,-7.62; 36 -1,-7.62; 37 -0.5,-7.62; 38 0,-7.62; 39 0.5,-7.62; 40 1,-7.62; 41 1.5,-7.62; 42 2,-7.62; 43 2.5,-7.62; 44 3,-7.62; 45 3.5,-7.62; 46 4,-7.62; 47 4.5,-7.62; 48 5,-7.62; 49 5.5,-7.62; 50 6,-7.62; 76 6,7.62; 77 5.5,7.62; 78 5,7.62; 79 4.5,7.62; 80 4,7.62; 81 3.5,7.62; 82 3,7.62; 83 2.5,7.62; 84 2,7.62; 85 1.5,7.62; 86 1,7.62; 87 0.5,7.62; 88 0,7.62; 89 -0.5,7.62; 90 -1,7.62; 91 -1.5,7.62; 92 -2,7.62; 93 -2.5,7.62; 94 -3,7.62; 95 -3.5,7.62; 96 -4,7.62; 97 -4.5,7.62; 98 -5,7.62; 99 -5.5,7.62; 100 -6,7.62
C1206 = smd 1.6 x 1.8: 1 -1.4,0; 2 1.4,0
C0603 = smd 1.1 x 1: 1 -0.85,0; 2 0.85,0
E2-4 = drill 0.813 pad 1.27: + -1.016,0 | drill 0.813 pad 1.27 octagon: - 1.016,0
E3,5-10 = drill 0.813 pad 1.6: + -1.778,0 | drill 0.813 pad 1.6 octagon: - 1.778,0
SOT23 = smd 1 x 1.4: 1 -0.95,-1.1; 2 0.95,-1.1; 3 0,1.1
SOIC127P600X175-8N = smd 1.525 x 0.65: 1 -2.712,1.905; 2 -2.712,0.635; 3 -2.712,-0.635; 4 -2.712,-1.905; 5 2.712,-1.905; 6 2.712,-0.635; 7 2.712,0.635; 8 2.712,1.905
2X08 = drill 1.016 octagon: 1 -8.89,-1.27; 2 -8.89,1.27; 3 -6.35,-1.27; 4 -6.35,1.27; 5 -3.81,-1.27; 6 -3.81,1.27; 7 -1.27,-1.27; 8 -1.27,1.27; 9 1.27,-1.27; 10 1.27,1.27; 11 3.81,-1.27; 12 3.81,1.27; 13 6.35,-1.27; 14 6.35,1.27; 15 8.89,-1.27; 16 8.89,1.27
CHIPLED_0603 = smd 0.8 x 0.8: A 0,-0.75; C 0,0.75
SQJ968EPT1GE3 = smd 0.41 x 0.72: 1 -1.905,-0.66; 2 -0.635,-0.66; 3 0.635,-0.66; 4 1.905,-0.66 | smd 1.73 x 3.99: 5 -1.115,3.135; 6 1.115,3.135 | smd 0.47 x 0.41: 7 2.215,4.926; 8 -2.215,4.926 | smd 0.585 x 0.51: 9 -2.215,1.95; 10 2.215,1.95
SOT23-BEC = smd 1 x 1.4: B -0.95,-1.1; C 0,1.1; E 0.95,-1.1
R0603 = smd 1 x 1.1: 1 -0.85,0; 2 0.85,0
R0805 = smd 1.3 x 1.5: 1 -0.95,0; 2 0.95,0
B3F-10XX = drill 1.016 long: 1 -3.251,2.261; 2 3.251,2.261; 3 -3.251,-2.261; 4 3.251,-2.261
1MS1T1B1M2QES-5 = drill 1.85 pad 2.8: 1 0,-4.7; 2 0,0; 3 0,4.7
FE20-2 = drill 0.914: 1 -24.13,1.27 | drill 0.914 octagon: 2 -24.13,-1.27; 3 -21.59,1.27; 4 -21.59,-1.27; 5 -19.05,1.27; 6 -19.05,-1.27; 7 -16.51,1.27; 8 -16.51,-1.27; 9 -13.97,1.27; 10 -13.97,-1.27; 11 -11.43,1.27; 12 -11.43,-1.27; 13 -8.89,1.27; 14 -8.89,-1.27; 15 -6.35,1.27; 16 -6.35,-1.27; 17 -3.81,1.27; 18 -3.81,-1.27; 19 -1.27,1.27; 20 -1.27,-1.27; 21 1.27,1.27; 22 1.27,-1.27; 23 3.81,1.27; 24 3.81,-1.27; 25 6.35,1.27; 26 6.35,-1.27; 27 8.89,1.27; 28 8.89,-1.27; 29 11.43,1.27; 30 11.43,-1.27; 31 13.97,1.27; 32 13.97,-1.27; 33 16.51,1.27; 34 16.51,-1.27; 35 19.05,1.27; 36 19.05,-1.27; 37 21.59,1.27; 38 21.59,-1.27; 39 24.13,1.27; 40 24.13,-1.27
5566-24 = drill 1.4 square: 1 23.1,-2.75; 2 18.9,-2.75; 3 14.7,-2.75; 4 10.5,-2.75; 5 6.3,-2.75; 6 2.1,-2.75; 7 -2.1,-2.75; 8 -6.3,-2.75; 9 -10.5,-2.75; 10 -14.7,-2.75; 11 -18.9,-2.75; 12 -23.1,-2.75; 13 23.1,2.75; 14 18.9,2.75; 15 14.7,2.75; 16 10.5,2.75; 17 6.3,2.75; 18 2.1,2.75; 19 -2.1,2.75; 20 -6.3,2.75; 21 -10.5,2.75; 22 -14.7,2.75; 23 -18.9,2.75; 24 -23.1,2.75 | hole 3: 27.8,2.29; -27.8,2.29

### Placement (x,y rotation side)
!BUSY  21.45,67.6 0 top
C1  91,3.25 90 top
C2  87.1,3.25 90 top
C3  5.85,66.95 0 top
C4  5.85,69.55 0 top
C5  5.85,72.15 0 top
C6  2.6,87.75 270 top
C7  39.65,76.7 90 top
C8  36.4,76.7 90 top
C9  33.15,76.05 90 top
C10  30.55,76.05 90 top
C11  17.55,96.85 0 bottom
C12  26.65,96.85 0 bottom
C13  5.2,87.75 270 top
C14  156.65,13 90 top
C15  152.75,13 90 top
C16  148.85,12.35 90 top
C17  145.6,12.35 90 top
C18  83.2,2.6 90 top
C19  79.95,2.6 90 top
C20  45.5,6.5 90 top
C21  41.6,6.5 90 top
C22  37.7,5.85 90 top
C23  34.45,5.85 90 top
C24  128.05,70.2 90 top
C25  124.15,70.2 90 top
C26  120.25,69.55 90 top
C27  117,69.55 90 top
C28  104,70.2 90 top
C29  100.1,70.2 90 top
C30  96.2,69.55 90 top
C31  92.95,69.55 90 top
C32  5.85,74.75 0 top
C33  37.05,65 270 top
C34  37.7,40.95 90 top
C35  39.65,65.65 270 top
C36  43.55,40.95 90 top
C37  14.95,73.45 0 bottom
C38  14.95,68.25 0 bottom
C39  15.6,70.85 0 bottom
C40  15.6,65.65 0 bottom
C41  52.65,41.6 90 top
D1  81.9,62.4 0 top
D2  76.7,62.4 0 top
D3  71.5,62.4 0 top
D4  66.3,62.4 0 top
D5  61.1,62.4 0 top
D6  55.9,62.4 0 top
D7  50.7,62.4 0 top
D8  45.5,62.4 0 top
D9  127.4,53.95 0 top
D10  122.2,53.95 0 top
D11  117,53.95 0 top
D12  111.8,53.95 0 top
D13  106.6,53.95 0 top
D14  101.4,53.95 0 top
D15  96.2,53.95 0 top
D16  91,53.95 0 top
D17  43.55,26 0 top
D18  38.35,26 0 top
D19  33.15,26 0 top
D20  27.95,26 0 top
D21  22.75,26 0 top
D22  17.55,26 0 top
D23  12.35,26 0 top
D24  7.15,26 0 top
D25  89.05,21.45 0 top
D26  83.85,21.45 0 top
D27  78.65,21.45 0 top
D28  73.45,21.45 0 top
D29  68.25,21.45 0 top
D30  63.05,21.45 0 top
D31  57.85,21.45 0 top
D32  52.65,21.45 0 top
D33  134.55,16.9 0 top
D34  129.35,16.9 0 top
D35  124.15,16.9 0 top
D36  118.95,16.9 0 top
D37  113.75,16.9 0 top
D38  108.55,16.9 0 top
D39  103.35,16.9 0 top
D40  98.15,16.9 0 top
IC1  8.45,81.25 270 top
JP1  63.05,70.85 180 top
JP2  108.55,62.4 180 top
JP3  24.7,34.45 180 top
JP4  70.2,29.9 180 top
JP5  115.7,25.35 180 top
LED1  135.8,100.2 0 top
LED2  140.95,100.2 0 top
LED3  146.2,100.2 0 top
LED4  151.45,100.1 0 top
LED_!LDAC  22.1,80.6 180 top
Q1  79.3,55.9 180 top
Q2  68.9,55.9 180 top
Q3  58.5,55.9 180 top
Q4  48.1,55.9 180 top
Q5  124.8,47.45 180 top
Q6  114.4,47.45 180 top
Q7  104,47.45 180 top
Q8  93.6,47.45 180 top
Q9  40.95,19.5 180 top
Q10  30.55,19.5 180 top
Q11  20.15,19.5 180 top
Q12  9.75,19.5 180 top
Q13  86.45,14.95 180 top
Q14  76.05,14.95 180 top
Q15  65.65,14.95 180 top
Q16  55.25,14.95 180 top
Q17  131.95,10.4 180 top
Q18  121.55,10.4 180 top
Q19  111.15,10.4 180 top
Q20  100.75,10.4 180 top
Q21  150.35,89.05 90 top
R1  18.2,48.1 90 top
R2  140.95,94.95 90 top
R3  146.2,95 90 top
R4  135.75,94.95 90 top
R5  22.1,85.8 270 top
R6  151.45,84.5 90 top
R7  151.45,95 270 top
R8  22.75,77.35 180 top
S1  10.4,44.85 180 top
S2  117.65,97.5 270 top
SV1  34,91.65 180 top
X1  150.15,50.05 270 top

### Tracks (layer width: path | path; a pad name or v marks a point on that pad's centre or on a via)
12V  (via drill 0.35)
  Top 0.254: JP2.9 108.55,63.67 | 99.63,63.7 JP2.15 | 54.13,72.15 JP1.15 | C15.1 152.85,11.5 | 61.28,31.2 JP4.15 | R3.1 146.2,90.4 v146.25,90.35 | v143.65,79.95 143.65,72.15
  Top 1.016: 95.35,31.17 95.35,6.2 C1.1 C2.1 83.3,1.85 C18.1 83.1,1.85 80.05,1.85 C19.1 | C23.1 C22.1 37.8,5.1 C21.1 C20.1 49.85,9.45 49.85,35.72 | C24.1 127.95,68.7 124.25,68.7 C25.1 124.05,68.7 C26.1 | C27.1 C26.1 | C28.1 103.9,68.7 100.2,68.7 C29.1 100,68.7 C30.1 C31.1 86.45,68.7 86.45,76.7 | C26.1 120.25,63.67 | 152.85,11.5 C16.1 C17.1 141.05,11.5 141.05,26.62 134.37,26.62 | C14.1 156.55,11.5 152.85,11.5 C15.1
  Top 1.27: C34.+ C36.+ 52.54,39.93 C41.+ 52.65,35.72
  Top 2.54: JP1.15 JP1.13 JP1.11 JP1.9 JP1.7 JP1.5 JP1.3 JP1.1 76.52,76.7 86.45,76.7 134.42,76.7 | JP2.15 JP2.13 JP2.11 JP2.9 | 108.55,63.67 JP2.7 JP2.5 JP2.3 JP2.1 120.25,63.67 128.17,63.67 132.85,68.35 | D9.3 D10.3 D11.3 D12.3 D13.3 D14.3 D15.3 D16.3 91,63.7 99.63,63.7 | D1.3 D2.3 D3.3 D4.3 D5.3 D6.3 D7.3 D8.3 45.5,72.15 54.13,72.15 | D33.3 D34.3 D35.3 D36.3 D37.3 D38.3 D39.3 D40.3 98.15,26.62 JP5.15 JP5.13 JP5.11 JP5.9 JP5.7 JP5.5 JP5.3 JP5.1 134.37,26.62 143.7,35.95 143.7,64.3 143.65,64.35 | D25.3 D26.3 D27.3 D28.3 D29.3 D30.3 D31.3 D32.3 52.65,31.2 61.28,31.2 | JP4.15 JP4.13 JP4.11 JP4.9 JP4.7 JP4.5 JP4.3 JP4.1 95.35,31.17 131.77,31.17 139.45,38.85 139.45,64.15 | D17.3 D18.3 D19.3 D20.3 D21.3 D22.3 D23.3 D24.3 7.15,35.72 JP3.15 JP3.13 JP3.11 JP3.9 JP3.7 JP3.5 JP3.3 JP3.1 49.85,35.72 52.65,35.72 129.47,35.72 135.25,41.5 135.25,64.3 135.2,64.35 | X1.11 146.9,69.45 146.9,69.55 148.2,69.55 148.2,67.6 146.25,67.6 | X1.10 146.9,65.25 146.9,65.65 148.2,65.65 148.2,63.7 146.9,63.7
  Bottom 0.254: v143.65,79.95 143.65,87.5 146.25,90.1 v146.25,90.35
  pour Top (hatched): 149.5,70.85 149.5,62.4 131.3,62.4 131.3,78.65 138.45,78.65 146.25,70.85
!BUSY
  Top 0.254: !BUSY.76 27.45,86.93 27.65,87.13 SV1.25
!CLR
  Top 0.254: !BUSY.2 13.02,73.1 12.77,73.34 12.77,77.11 13.7,78.03 13.7,91.64 21.31,91.64 SV1.29
!LDAC
  Top 0.254: !BUSY.77 26.95,78.87 23.85,81.97 23.85,86.75 R5.1 22.1,88.05 24.43,90.38 SV1.27
!RESET  (via drill 0.35)
  Top 0.254: S1.4 S1.3 18.06,47.11 R1.1 21.65,50.7 v23.4,50.7 | !BUSY.75 32.35,73.6 35.1,70.85 v35.1,70.2 | v35.1,55.9 v27.3,55.9
  Bottom 0.254: v35.1,70.2 v35.1,55.9 | v27.3,55.9 27.3,54.6 v23.4,50.7
!SYNC
  Top 0.254: !BUSY.100 15.45,88.34 SV1.33
AVDD(5V)  (via drill 0.35)
  Top 0.254: !BUSY.60 | !BUSY.10 | 16.95,65.49 16.95,65.5 | 16.94,69.1 16.95,69.1 | R2.1 141,93.95 141,82.65
  Top 0.305: !BUSY.60 27.85,66.1 | 16.95,65.49 16.95,64.6 | 16.95,64.6 !BUSY.29 | 27.85,66.1 27.85,62.35 28.1,62.1 !BUSY.52 | 27.85,66.1 27.85,73.45 16.95,73.45 16.95,70.2 | 16.95,70.2 16.95,69.1 16.95,66.3 | 16.95,66.3 16.95,65.5 | !BUSY.19 16.95,64.6 | !BUSY.10 16.94,69.1 | 68.25,82.65 52.95,82.65 39.65,69.35 C35.1 39.25,66.1 37.35,66.1 C33.1 36.75,66.1 !BUSY.60 | v17.85,70.2 16.95,70.2 | v17.85,66.3 16.95,66.3
  Top 0.508: IC1.2 9.09,86.65 7.79,86.65 7.79,88.6 | 7.79,88.6 7.79,92.92 SV1.40 | C6.1 3.15,88.6 C13.1 7.79,88.6 | v22.1,96.2 22.1,100.45 | v29.9,96.2 29.9,100.45
  Top 1.27: X1.23 152.9,69.6 149.65,72.85 149.65,79.6 146.6,82.65 141,82.65 68.25,82.65 68.25,100.45 29.9,100.45 22.1,100.45 9.87,100.45 SV1.40 SV1.38
  Bottom 0.305: C38.1 16.35,65.75 C40.1 17.2,65.65 v17.85,66.3 | C37.1 16.35,70.95 C39.1 17.2,70.85 v17.85,70.2
  Bottom 0.508: v22.1,96.2 21.45,96.85 C11.1 | v29.9,96.2 29.25,96.85 C12.1
DRAIN0
  Top 0.254: Q1.5 80.53,52.65 80.6,52.72 80.6,55.25 76.7,55.25 76.7,57.05 D1.1 81.19,61.3 82.22,60.27 83.48,60.27 83.68,60.47 83.68,63.98 82.56,65.1 54.16,65.1 JP1.16
DRAIN1
  Top 0.254: D2.1 75.75,52.65 78.07,52.65 Q1.6 78.19,50.44 81.89,50.44 84.13,52.69 84.13,64.17 82.75,65.55 56.55,65.55 56.55,69.43 JP1.14
DRAIN2
  Top 0.254: D3.1 66.3,57.05 66.3,55.25 70.2,55.25 70.2,52.72 70.13,52.65 Q2.5 75.3,52.77 75.3,51.86 77.17,49.99 82.07,49.99 84.58,52.5 84.58,64.36 82.94,66 59.15,66 59.15,69.49 JP1.12
DRAIN3
  Top 0.254: D4.1 65.35,52.65 67.67,52.65 Q2.6 68.82,51.73 68.82,50.63 69.92,49.53 82.26,49.53 85.04,52.31 85.04,64.55 83.13,66.46 61.75,66.46 61.75,69.55 JP1.10
DRAIN4
  Top 0.254: D5.1 55.9,57.05 55.9,55.25 59.8,55.25 59.8,52.72 59.73,52.65 Q3.5 63.99,52.77 67.68,49.08 82.45,49.08 85.49,52.12 85.49,64.73 83.31,66.91 64.32,66.91 JP1.8
DRAIN5
  Top 0.254: D6.1 54.95,52.65 57.27,52.65 Q3.6 58.42,51.73 58.42,50.63 60.43,48.63 82.64,48.63 85.95,51.94 85.95,64.92 83.5,67.37 66.86,67.37 JP1.6
DRAIN6
  Top 0.254: D7.1 45.5,57.05 45.5,55.25 49.4,55.25 49.4,52.72 49.33,52.65 Q4.5 53.59,52.77 58.19,48.17 82.83,48.17 86.4,51.75 86.4,65.11 83.69,67.82 69.4,67.82 JP1.4
DRAIN7
  Top 0.254: D8.1 44.55,52.65 46.87,52.65 Q4.6 48.02,51.73 48.02,50.63 50.94,47.72 83.01,47.72 86.86,51.56 86.86,65.3 83.88,68.28 71.94,68.28 JP1.2
DRAIN8
  Top 0.254: Q5.5 126.03,44.2 126.1,44.27 126.1,46.8 122.2,46.8 122.2,48.6 D9.1 126.69,52.85 127.72,51.82 128.99,51.82 129.18,52.02 129.18,55.53 128.06,56.65 99.66,56.65 JP2.16
DRAIN9
  Top 0.254: D10.1 121.25,44.2 123.57,44.2 Q5.6 124.72,43.28 124.72,42.19 124.92,41.99 127.39,41.99 129.63,44.24 129.63,55.72 128.25,57.1 102.2,57.1 JP2.14
DRAIN10
  Top 0.254: D11.1 111.8,48.6 111.8,46.8 115.7,46.8 115.7,44.27 115.63,44.2 Q6.5 119.89,44.31 122.67,41.54 127.57,41.54 130.09,44.05 130.09,55.91 128.44,57.55 104.74,57.55 JP2.12
DRAIN11
  Top 0.254: D12.1 110.85,44.2 113.17,44.2 Q6.6 114.32,43.28 114.32,42.19 115.42,41.08 127.76,41.08 130.54,43.86 130.54,56.1 128.63,58.01 107.28,58.01 JP2.10
DRAIN12
  Top 0.254: D13.1 101.4,48.6 101.4,46.8 105.3,46.8 105.3,44.5 Q7.5 109.49,44.31 113.18,40.63 127.95,40.63 130.99,43.67 130.99,56.28 128.81,58.46 109.82,58.46 JP2.8
DRAIN13
  Top 0.254: D14.1 100.45,44.2 102.77,44.2 Q7.6 103.92,43.28 103.92,42.19 105.93,40.18 128.14,40.18 131.45,43.48 131.45,56.47 129,58.92 112.36,58.92 JP2.6
DRAIN14
  Top 0.254: D15.1 91,48.6 91,46.8 94.9,46.8 94.9,44.27 94.83,44.2 Q8.5 99.09,44.31 103.69,39.72 128.33,39.72 131.9,43.3 131.9,56.66 129.19,59.37 114.9,59.37 JP2.4
DRAIN15
  Top 0.254: D16.1 90.05,44.2 92.37,44.2 Q8.6 93.52,43.28 93.52,42.19 96.44,39.27 128.51,39.27 132.35,43.11 132.35,56.85 129.38,59.83 117.44,59.83 JP2.2
DRAIN16
  Top 0.254: Q9.5 42.25,16.55 42.25,18.85 38.35,18.85 38.35,20.65 D17.1 42.84,24.9 43.87,23.87 45.13,23.87 45.33,24.07 45.33,27.58 44.21,28.7 15.81,28.7 JP3.16
DRAIN17
  Top 0.254: D18.1 37.4,16.55 37.7,16.25 39.72,16.25 Q9.6 39.84,14.04 43.53,14.04 45.78,16.29 45.78,27.77 44.4,29.15 18.35,29.15 JP3.14
DRAIN18
  Top 0.254: D19.1 27.95,20.65 27.95,18.85 31.85,18.85 31.85,16.32 31.78,16.25 Q10.5 36.04,16.36 38.82,13.59 43.72,13.59 46.23,16.1 46.23,27.96 44.59,29.61 20.89,29.61 JP3.12
DRAIN19
  Top 0.254: D20.1 27,16.55 27.3,16.25 29.32,16.25 Q10.6 30.47,15.33 30.47,14.23 31.57,13.13 43.91,13.13 46.69,15.91 46.69,28.15 44.78,30.06 23.43,30.06 JP3.10
DRAIN20
  Top 0.254: D21.1 17.55,20.65 17.55,18.85 21.45,18.85 21.45,16.32 21.38,16.25 Q11.5 25.64,16.36 29.33,12.68 44.1,12.68 47.14,15.72 47.14,28.33 44.96,30.51 25.97,30.51 JP3.8
DRAIN21
  Top 0.254: D22.1 16.6,16.55 16.9,16.25 18.92,16.25 Q11.6 20.07,15.33 20.07,14.23 22.08,12.23 44.29,12.23 47.6,15.54 47.6,28.52 45.15,30.97 28.51,30.97 JP3.6
DRAIN22
  Top 0.254: D23.1 7.15,20.65 7.15,18.85 11.05,18.85 11.05,16.32 10.98,16.25 Q12.5 15.24,16.36 19.84,11.77 44.48,11.77 48.05,15.35 48.05,28.71 45.34,31.42 31.05,31.42 JP3.4
DRAIN23
  Top 0.254: D24.1 6.2,16.55 6.5,16.25 8.52,16.25 Q12.6 9.67,15.33 9.67,14.23 12.59,11.32 44.66,11.32 48.51,15.16 48.51,28.9 45.53,31.88 33.59,31.88 JP3.2
DRAIN24
  Top 0.254: Q13.5 87.68,11.7 87.75,11.77 87.75,14.3 83.85,14.3 83.85,16.1 D25.1 88.34,20.35 89.36,19.32 90.64,19.32 90.83,19.52 90.83,23.03 89.71,24.15 61.31,24.15 JP4.16
DRAIN25
  Top 0.254: D26.1 82.9,12 83.2,11.7 85.22,11.7 | 85.22,11.7 Q13.6 | JP4.14 63.85,24.6 89.9,24.6 91.28,23.22 91.28,11.74 89.03,9.49 85.22,9.49 85.22,11.7
DRAIN26
  Top 0.254: D27.1 73.45,16.1 73.45,14.3 77.35,14.3 77.35,11.77 77.28,11.7 Q14.5 81.54,11.81 84.32,9.04 89.22,9.04 91.73,11.55 91.73,23.41 90.09,25.05 66.39,25.05 JP4.12
DRAIN27
  Top 0.254: D28.1 72.5,12 72.8,11.7 74.82,11.7 Q14.6 75.97,10.78 75.97,9.69 77.07,8.58 89.41,8.58 92.19,11.36 92.19,23.6 90.28,25.51 68.93,25.51 JP4.10
DRAIN28
  Top 0.254: D29.1 63.05,16.1 63.05,14.3 66.95,14.3 66.95,11.77 66.88,11.7 Q15.5 71.14,11.81 74.83,8.13 89.6,8.13 92.64,11.17 92.64,23.78 90.46,25.96 71.47,25.96 JP4.8
DRAIN29
  Top 0.254: D30.1 62.1,12 62.4,11.7 64.42,11.7 Q15.6 65.57,10.78 65.57,9.69 67.58,7.68 89.79,7.68 93.1,10.98 93.1,23.97 90.65,26.42 74.01,26.42 JP4.6
DRAIN30
  Top 0.254: D31.1 52.65,16.1 52.65,14.3 56.55,14.3 56.55,11.77 56.48,11.7 Q16.5 60.74,11.81 65.33,7.22 89.98,7.22 93.55,10.8 93.55,24.16 90.84,26.87 76.55,26.87 JP4.4
DRAIN31
  Top 0.254: D32.1 51.7,12 52,11.7 54.02,11.7 Q16.6 55.17,10.78 55.17,9.69 58.09,6.77 90.16,6.77 94,10.61 94,24.35 91.03,27.32 79.09,27.32 JP4.2
DRAIN32
  Top 0.254: Q17.5 133.18,7.15 133.25,7.22 133.25,9.75 129.35,9.75 129.35,11.55 D33.1 133.84,15.8 134.87,14.77 136.13,14.77 136.33,14.96 136.33,18.48 135.21,19.6 106.81,19.6 JP5.16
DRAIN33
  Top 0.254: D34.1 128.4,7.45 128.7,7.15 130.72,7.15 Q17.6 130.84,4.94 134.53,4.94 136.78,7.19 136.78,18.67 135.4,20.05 109.2,20.05 109.2,23.93 JP5.14
DRAIN34
  Top 0.254: D35.1 118.95,11.55 118.95,9.75 122.85,9.75 122.85,7.22 122.78,7.15 Q18.5 127.95,7.26 127.95,6.36 129.82,4.49 134.72,4.49 137.24,7 137.24,18.86 135.59,20.5 111.89,20.5 JP5.12
DRAIN35
  Top 0.254: D36.1 118,7.45 118.3,7.15 120.32,7.15 Q18.6 121.47,6.23 121.47,5.13 122.57,4.03 134.91,4.03 137.69,6.81 137.69,19.05 135.78,20.96 114.4,20.96 114.4,24.05 JP5.10
DRAIN36
  Top 0.254: D37.1 108.55,11.55 108.55,9.75 112.45,9.75 112.45,7.22 112.38,7.15 Q19.5 116.64,7.26 120.33,3.58 135.1,3.58 138.14,6.62 138.14,19.23 135.96,21.41 116.97,21.41 JP5.8
DRAIN37
  Top 0.254: D38.1 107.6,7.45 107.9,7.15 109.92,7.15 Q19.6 111.07,6.23 111.07,5.13 113.08,3.13 135.29,3.13 138.6,6.43 138.6,19.42 136.15,21.87 119.51,21.87 JP5.6
DRAIN38
  Top 0.254: D39.1 98.15,11.55 98.15,9.75 102.05,9.75 102.05,7.22 101.98,7.15 Q20.5 106.24,7.26 110.83,2.67 135.48,2.67 139.05,6.25 139.05,19.61 136.34,22.32 122.05,22.32 JP5.4
DRAIN39
  Top 0.254: D40.1 97.2,7.45 97.5,7.15 99.52,7.15 Q20.6 100.67,6.23 100.67,5.13 103.59,2.22 135.66,2.22 139.5,6.06 139.5,19.8 136.53,22.77 124.59,22.77 JP5.2
DVDD(3.3V)  (via drill 0.35)
  Top 0.254: 43.45,75.3 C7.1 | 24.45,74.11 24.45,74.16 | !BUSY.83 !BUSY.82 | v2.6,77.35 2.57,77.32 | R4.1 v135.75,87.1 | v148.85,85.15 148.85,88.65 Q21.C | R8.2 v20.15,77.35
  Top 0.305: 24.45,74.16 !BUSY.82 | v20.15,77.35 19.45,76.65 !BUSY.92 19.45,74.26 19.59,74.11 24.45,74.11 29.25,74.11 30.34,75.2 C10.1 C9.1 36.3,75.2 C8.1 36.5,75.2 39.55,75.2 C7.1 | R1.2 18.2,50.9 13.65,55.45 7.95,55.45 2.57,60.82 2.57,77.32 | v53.3,85.15 43.45,75.3
  Bottom 0.254: 135.75,83.8 132.45,87.1 | v148.85,85.15 148.85,74.6 X1.12
  Bottom 0.305: v20.15,77.35 v2.6,77.35 | v135.75,87.1 132.45,87.1 55.25,87.1 v53.3,85.15 | X1.12 146.4,73.15 135.75,83.8
GND  (via drill 0.35)
  Top 0.254: !BUSY.81 24.95,76.4 | 25.95,76.4 !BUSY.79 | !BUSY.97 | !BUSY.97 | 19.95,76.4 !BUSY.91 | C15.2 v152.75,15.85 | C22.2 v37.7,7.8 | C27.2 v117,71.5 | C6.2 v2.6,84.9 | C13.2 v5.2,85.8 | C14.2 v156.65,15.85 | C16.2 v148.85,14.3 | C17.2 v145.6,14.3 | IC1.4 v6.54,85.28 | C24.2 v128.05,73.05 | C21.2 v41.6,9.35 | C33.2 v37.05,62.15 | LED2.C v140,100.95 | C1.2 v91,6.1 | C19.2 v79.95,4.55 | C32.2 v8.7,74.75 | C29.2 v100.1,73.05 | LED1.C v134.85,100.95 | LED3.C v145.25,100.95 | C18.2 v83.2,4.55 | C20.2 v45.5,9.35 | C23.2 v34.45,7.8 | C25.2 v124.15,73.05 | C26.2 v120.25,71.5 | C35.2 v39.65,63.7 | !BUSY.47 25.95,58.5 | !BUSY.51 30,61.6 | !BUSY.58 30.3,65.1 | !BUSY.46 25.45,58.5 | !BUSY.59 30.3,65.6 | !BUSY.57 30.3,64.6 | !BUSY.7 15,70.6 | !BUSY.25 15,61.6 | !BUSY.17 15,65.6 | !BUSY.15 15,66.6 | !BUSY.9 15,69.6 | !BUSY.1 15,73.6 | !BUSY.97 16.95,76 | !BUSY.90 20.45,76.4
  Bottom 0.254: C11.2 v14.7,96.85 | C12.2 v24.7,96.85
  other vias: 51.35,58.5 61.75,58.5 72.15,58.5 82.55,58.5 104,13 114.4,13 124.8,13 135.2,13 58.5,17.55 68.9,17.55 79.3,17.55 89.7,17.55 13,22.1 23.4,22.1 33.8,22.1 44.2,22.1 96.85,50.05 107.25,50.05 117.65,50.05 128.05,50.05 6.5,64.35
  pour Top (rank 2): -1.3,106.6 -1.3,-1.3 161.2,-1.3 161.2,106.6
  pour Bottom: -1.95,107.25 -1.95,-1.95 161.85,-1.95 161.85,107.25
MISO  (via drill 0.35)
  Top 0.254: v18.85,79.3 18.85,76.13 18.95,76.04 !BUSY.93
  Bottom 0.254: v18.85,79.3 24.05,79.3 35.13,90.38 SV1.19
MOSI  (via drill 0.35)
  Top 0.254: v16.25,78.65 16.25,77.33 15.95,77.03 !BUSY.99
  Bottom 0.254: v16.25,78.65 16.25,79.01 17.87,80.63 22.98,80.63 SV1.21
N$1
  Top 0.254: LED2.A R2.2
N$3
  Top 0.254: R4.2 135.75,99.4 LED1.A
N$4
  Top 0.254: LED3.A R3.2
N$5
  Top 0.254: R5.2 LED_!LDAC.A
N$6
  Top 0.254: Q21.B R6.2
N$7
  Top 0.254: R7.2 Q21.E
N$8
  Top 0.254: R7.1 LED4.A
POWER_GOOD
  Top 0.254: R6.1 156,79 156,60.29 154.19,58.48 151.41,58.48 149.29,56.35 X1.8
PSU_EN  (via drill 0.35)
  Top 0.254: S2.2 v117.65,85.15
  Bottom 0.254: v117.65,85.15 133.25,69.55 133.25,48.75 140.42,41.58 148.88,41.58 150.91,39.55 X1.16
SCLK  (via drill 0.35)
  Top 0.254: !BUSY.98 16.45,76.64 17.55,77.73 v17.55,78.65
  Bottom 0.254: v17.55,78.65 18.17,78.03 23.78,78.03 30.4,84.65 32.08,84.65 SV1.17
SER/PAR
  Top 0.254: R8.1 25.05,77.35 25.45,76.95 !BUSY.80
VOUT0  (via drill 0.35)
  Top 0.254: Q1.2 81.25,57.88 v81.25,58.5 | v7.8,64.35 7.83,64.38 12.74,64.38 13.02,64.1 !BUSY.20
  Bottom 0.254: v7.8,64.35 8.14,64.35 8.17,64.38 18.88,64.38 34.45,79.95 60.57,79.95 67.95,72.57 67.95,72.03 69.31,70.67 69.85,70.67 70.49,70.03 70.49,69.26 v81.25,58.5
VOUT1  (via drill 0.35)
  Top 0.254: Q1.4 79.33,58.5 v79.95,58.5 | v8.45,63.7 8.5,63.75 12.47,63.75 12.63,63.59 !BUSY.21
  Bottom 0.254: v8.45,63.7 18.85,63.7 34.45,79.3 58.68,79.3 65.77,72.21 65.77,71.67 66.41,71.03 66.95,71.03 68.31,69.67 68.31,69.13 68.95,68.49 69.96,68.49 v79.95,58.5
VOUT2  (via drill 0.35)
  Top 0.254: Q2.2 70.85,57.88 v70.85,58.5 | v7.8,62.4 8.42,63.02 8.73,63.02 8.81,63.1 !BUSY.22
  Bottom 0.254: v7.8,62.4 8.14,62.4 8.17,62.43 18.23,62.43 34.45,78.65 51.71,78.65 57.79,72.57 57.79,72.03 59.15,70.67 59.69,70.67 60.33,70.03 60.33,69.02 v70.85,58.5
VOUT3  (via drill 0.35)
  Top 0.254: Q2.4 68.94,58.5 v69.55,58.5 | v8.45,61.75 9.3,62.6 !BUSY.23
  Bottom 0.254: v8.45,61.75 18.2,61.75 34.45,78 49.82,78 55.61,72.21 55.61,71.67 56.25,71.03 56.79,71.03 58.15,69.67 58.15,69.13 58.79,68.49 59.56,68.49 v69.55,58.5
VOUT4  (via drill 0.35)
  Top 0.254: Q3.2 60.45,57.88 v60.45,58.5 | v6.5,60.45 7.1,61.05 9,61.05 10.05,62.1 12.35,62.1 !BUSY.24
  Bottom 0.254: v6.5,60.45 8.14,60.45 8.17,60.48 17.58,60.48 34.45,77.35 41.6,77.35 v60.45,58.5
VOUT5  (via drill 0.35)
  Top 0.254: Q3.4 58.53,58.5 v59.15,58.5 | v8.45,59.8 9.1,59.8 10.4,58.5 16.78,58.5 17.45,59.17 !BUSY.30
  Bottom 0.254: v8.45,59.8 8.67,60.02 17.77,60.02 34.44,76.7 40.95,76.7 v59.15,58.5
VOUT6  (via drill 0.35)
  Top 0.254: Q4.2 50.05,57.88 v50.05,58.5 | !BUSY.31 17.95,58.96 16.83,57.85 9.75,57.85 9.07,58.53 8.17,58.53 8.14,58.5 v7.8,58.5
  Bottom 0.254: v7.8,58.5 8.42,59.12 17.51,59.12 34.43,76.05 39,76.05 50.05,65 v50.05,58.5
VOUT7  (via drill 0.35)
  Top 0.254: Q4.4 48.13,58.5 v48.75,58.5 | !BUSY.32 18.45,58.51 17.13,57.2 9.1,57.2 v8.45,57.85
  Bottom 0.254: v8.45,57.85 9.27,58.67 17.7,58.67 34.43,75.4 39,75.4 48.75,65.65 v48.75,58.5
VOUT8  (via drill 0.35)
  Top 0.254: v18.2,72.15 18.2,71.81 18.17,71.78 18.17,71.22 18.85,70.54 18.85,65.54 22.95,61.44 !BUSY.41 | Q5.2 126.75,49.42 v126.75,50.05
  Bottom 0.254: v18.2,72.15 18.54,72.15 30.59,84.2 93.37,84.2 113.45,64.12 113.45,63.58 114.81,62.22 115.35,62.22 115.99,61.58 115.99,60.81 v126.75,50.05
VOUT9  (via drill 0.35)
  Top 0.254: v18.85,71.5 19.5,70.85 19.5,65.65 23.45,61.7 !BUSY.42 | Q5.4 124.83,50.05 v125.45,50.05
  Bottom 0.254: v18.85,71.5 19.47,72.12 19.47,72.43 30.79,83.74 91.29,83.74 111.27,63.76 111.27,63.22 111.91,62.58 112.45,62.58 113.81,61.22 113.81,60.68 114.45,60.04 115.46,60.04 v125.45,50.05
VOUT10  (via drill 0.35)
  Top 0.254: v20.15,72.15 20.15,71.81 20.12,71.78 20.12,65.67 23.95,61.84 !BUSY.43 | Q6.2 116.35,49.42 v116.35,50.05
  Bottom 0.254: v20.15,72.15 20.49,72.15 31.63,83.29 84.12,83.29 103.29,64.12 103.29,63.58 104.65,62.22 105.19,62.22 105.83,61.58 105.83,60.57 v116.35,50.05
VOUT11  (via drill 0.35)
  Top 0.254: v20.8,71.5 20.8,65.65 24.45,62 !BUSY.44 | Q6.4 114.44,50.05 v115.05,50.05
  Bottom 0.254: v115.05,50.05 105.06,60.04 104.29,60.04 103.65,60.68 103.65,61.22 102.29,62.58 101.75,62.58 101.11,63.22 101.11,63.76 82.03,82.83 31.83,82.83 21.42,72.43 21.42,72.12 v20.8,71.5
VOUT12  (via drill 0.35)
  Top 0.254: v22.1,72.15 22.1,71.81 21.42,71.13 21.42,65.67 24.95,62.14 !BUSY.45 | Q7.2 105.95,49.42 v105.95,50.05
  Bottom 0.254: v22.1,72.15 22.44,72.15 32.67,82.38 73.62,82.38 v105.95,50.05
VOUT13  (via drill 0.35)
  Top 0.254: v22.75,71.5 22.1,70.85 22.1,65.65 26.45,61.3 !BUSY.48 | Q7.4 104.03,50.05 v104.65,50.05
  Bottom 0.254: v22.75,71.5 23.37,72.12 23.37,72.43 32.87,81.93 72.77,81.93 v104.65,50.05
VOUT14  (via drill 0.35)
  Top 0.254: v24.05,72.15 24.05,71.81 22.72,70.48 22.72,65.67 26.95,61.44 !BUSY.49 | Q8.2 95.55,49.42 v95.55,50.05
  Bottom 0.254: v24.05,72.15 24.39,72.15 33.67,81.43 66.02,81.43 95.55,51.9 v95.55,50.05
VOUT15  (via drill 0.35)
  Top 0.254: !BUSY.50 27.45,61.61 23.4,65.66 23.4,70.2 v24.7,71.5 | Q8.4 93.64,50.05 v94.25,50.05
  Bottom 0.254: v24.7,71.5 34.15,80.95 64.95,80.95 94.25,51.65 v94.25,50.05
VOUT16  (via drill 0.35)
  Top 0.254: Q9.2 42.9,21.48 v42.9,22.1 | v33.15,61.75 32.81,61.75 32.78,61.72 30.76,61.72 29.88,62.6 !BUSY.53
  Bottom 0.254: v33.15,61.75 33.15,38.34 35.13,36.36 35.13,29.87 v42.9,22.1
VOUT17  (via drill 0.35)
  Top 0.254: Q9.4 40.98,22.1 v41.6,22.1 | v32.5,62.4 30.73,62.4 30.02,63.11 !BUSY.54
  Bottom 0.254: v41.6,22.1 34.68,29.02 34.68,36.17 32.45,38.4 32.45,62.35 v32.5,62.4
VOUT18  (via drill 0.35)
  Top 0.254: Q10.2 32.5,21.48 v32.5,22.1 | v33.15,63.7 33.05,63.6 !BUSY.55
  Bottom 0.254: v33.15,63.7 32.53,63.08 32.22,63.08 31.82,62.68 31.82,62.37 31.2,61.75 31.2,37.7 32.5,36.4 v32.5,22.1
VOUT19  (via drill 0.35)
  Top 0.254: Q10.4 30.59,22.1 v31.2,22.1 | v32.5,64.35 32.25,64.1 !BUSY.56
  Bottom 0.254: v32.5,64.35 29.9,61.75 29.9,23.4 v31.2,22.1
VOUT20  (via drill 0.35)
  Top 0.254: Q11.2 22.1,21.48 v22.1,22.1 | v33.15,67.6 32.15,66.6 !BUSY.61
  Bottom 0.254: v33.15,67.6 22.1,56.55 v22.1,22.1
VOUT21  (via drill 0.35)
  Top 0.254: Q11.4 20.18,22.1 v20.8,22.1 | v32.5,68.25 31.35,67.1 !BUSY.62
  Bottom 0.254: v32.5,68.25 32.5,67.91 19.8,55.21 19.8,23.1 v20.8,22.1
VOUT22  (via drill 0.35)
  Top 0.254: Q12.2 11.7,21.48 v11.7,22.1 | v33.15,69.55 32.53,68.93 32.22,68.93 30.89,67.6 !BUSY.63
  Bottom 0.254: v33.15,69.55 32.53,68.93 32.22,68.93 11.05,47.76 11.05,22.75 v11.7,22.1
VOUT23  (via drill 0.35)
  Top 0.254: Q12.4 9.79,22.1 v10.4,22.1 | v32.5,70.2 30.4,68.1 !BUSY.64
  Bottom 0.254: v32.5,70.2 10.4,48.1 v10.4,22.1
VOUT24  (via drill 0.35)
  Top 0.254: Q13.2 88.4,16.93 v88.4,17.55 | v9.75,72.8 10.09,72.8 10.12,72.83 11.43,72.83 11.66,72.6 !BUSY.3
  Bottom 0.254: v88.4,17.55 88.06,17.55 84.66,14.15 9.36,14.15 2.12,21.39 2.12,69.38 5.54,72.8 v9.75,72.8
VOUT25  (via drill 0.35)
  Top 0.254: Q13.4 86.48,17.55 v87.1,17.55 | !BUSY.4 10.45,72.1 v10.4,72.15
  Bottom 0.254: v87.1,17.55 80.26,17.55 77.31,14.6 9.54,14.6 2.57,21.57 2.57,69.18 4.92,71.53 9.78,71.53 v10.4,72.15
VOUT26  (via drill 0.35)
  Top 0.254: Q14.2 78,16.93 v78,17.55 | v9.75,70.85 10.37,71.47 10.68,71.47 10.81,71.6 !BUSY.5
  Bottom 0.254: v78,17.55 77.66,17.55 75.16,15.06 9.73,15.06 3.03,21.76 3.03,68.98 4.89,70.85 v9.75,70.85
VOUT27  (via drill 0.35)
  Top 0.254: Q14.4 76.08,17.55 v76.7,17.55 | v10.4,70.2 11.3,71.1 !BUSY.6
  Bottom 0.254: v76.7,17.55 69.86,17.55 67.82,15.51 9.92,15.51 3.48,21.95 3.48,68.79 4.82,70.13 10.33,70.13 v10.4,70.2
VOUT28  (via drill 0.35)
  Top 0.254: Q15.2 67.6,16.93 v67.6,17.55 | v9.75,68.9 10.09,68.9 10.12,68.93 12.69,68.93 13.02,68.59 !BUSY.11
  Bottom 0.254: v67.6,17.55 67.26,17.55 65.67,15.96 10.11,15.96 3.94,22.14 3.94,65.32 7.65,69.03 9.62,69.03 v9.75,68.9
VOUT29  (via drill 0.35)
  Top 0.254: Q15.4 65.69,17.55 v66.3,17.55 | v10.4,68.25 12.72,68.25 12.89,68.09 13.82,68.09 !BUSY.12
  Bottom 0.254: v10.4,68.25 10.33,68.18 7.43,68.18 4.39,65.13 4.39,22.33 10.3,16.42 65.17,16.42 v66.3,17.55
VOUT30  (via drill 0.35)
  Top 0.254: Q16.2 57.2,16.93 v57.2,17.55 | v9.75,66.95 10.37,67.57 10.68,67.57 10.71,67.6 !BUSY.13
  Bottom 0.254: v9.75,66.95 6.85,66.95 4.84,64.94 4.84,22.51 10.48,16.87 56.18,16.87 56.86,17.55 v57.2,17.55
VOUT31  (via drill 0.35)
  Top 0.254: Q16.4 55.28,17.55 v55.9,17.55 | v10.4,66.3 11.2,67.1 !BUSY.14
  Bottom 0.254: v10.4,66.3 10.35,66.25 6.79,66.25 5.3,64.75 5.3,22.7 10.65,17.35 55.7,17.35 v55.9,17.55
VOUT32  (via drill 0.35)
  Top 0.254: Q17.2 133.9,12.38 v133.9,13 | !BUSY.33 18.95,57.21 28.07,48.1 v34.45,48.1
  Bottom 0.254: v34.45,48.1 34.79,48.1 41.64,54.95 87.75,54.95 94.59,48.1 99.57,48.1 120.6,27.07 120.6,26.53 121.96,25.17 122.5,25.17 123.14,24.53 123.14,23.76 v133.9,13
VOUT33  (via drill 0.35)
  Top 0.254: Q17.4 131.99,13 v132.6,13 | v35.1,47.45 35.15,47.5 35.15,48.8 28.02,48.8 19.46,57.36 !BUSY.34
  Bottom 0.254: v35.1,47.45 35.72,48.07 35.72,48.38 41.84,54.49 87.56,54.49 94.6,47.45 97.68,47.45 118.42,26.71 118.42,26.17 119.06,25.53 119.6,25.53 120.96,24.17 120.96,23.63 121.6,22.99 122.61,22.99 v132.6,13
VOUT34  (via drill 0.35)
  Top 0.254: Q18.2 123.5,12.38 v123.5,13 | v36.4,48.1 36.4,48.19 35.34,49.25 28.25,49.25 19.95,57.55 !BUSY.35
  Bottom 0.254: v36.4,48.1 36.74,48.1 42.68,54.04 87.37,54.04 110.44,30.97 110.44,26.53 111.8,25.17 112.34,25.17 112.98,24.53 112.98,23.52 v123.5,13
VOUT35  (via drill 0.35)
  Top 0.254: Q18.4 121.58,13 v122.2,13 | v37.05,47.45 37.05,47.79 37.08,47.82 37.08,48.38 35.75,49.71 28.43,49.71 20.45,57.69 !BUSY.36
  Bottom 0.254: v122.2,13 112.21,22.99 111.44,22.99 110.8,23.63 110.8,24.17 109.44,25.53 108.9,25.53 108.26,26.17 108.26,30.61 85.28,53.59 42.88,53.59 37.67,48.38 37.67,48.07 v37.05,47.45
VOUT36  (via drill 0.35)
  Top 0.254: Q19.2 113.1,12.38 v113.1,13 | v38.35,48.1 38,48.1 35.94,50.16 28.62,50.16 20.95,57.83 !BUSY.37
  Bottom 0.254: v38.35,48.1 38.69,48.1 43.72,53.13 76.13,53.13 113.1,16.16 v113.1,13
VOUT37  (via drill 0.35)
  Top 0.254: Q19.4 111.19,13 v111.8,13 | v39,47.45 39,47.79 39.03,47.82 39.03,48.38 36.79,50.62 28.81,50.62 21.45,57.98 !BUSY.38
  Bottom 0.254: v111.8,13 108.86,13 69.18,52.68 43.92,52.68 39.62,48.38 39.62,48.07 v39,47.45
VOUT38  (via drill 0.35)
  Top 0.254: Q20.2 102.7,12.38 v102.7,13 | v40.3,48.1 39.95,48.1 36.98,51.07 29,51.07 21.95,58.12 !BUSY.39
  Bottom 0.254: v102.7,13 102.7,17.24 67.84,52.1 44.3,52.1 v40.3,48.1
VOUT39  (via drill 0.35)
  Top 0.254: Q20.4 100.78,13 v101.4,13 | v40.95,47.45 40.95,47.79 40.98,47.82 40.98,48.38 37.83,51.52 29.19,51.52 22.45,58.26 !BUSY.40
  Bottom 0.254: v40.95,47.45 44.85,51.35 66.95,51.35 101.4,16.9 v101.4,13
VREF(2.5V)
  Top 0.254: C5.1 5,72.15
  Top 0.305: !BUSY.16 12.73,66.1 11.73,65.1 6.15,65.1 5,66.25 C3.1 C4.1 5,72.15 5,72.7 4.45,73.25 C32.1 | 7.82,77.56 IC1.6
  Top 0.508: C32.1 4.55,74.85 4.55,76.4 7.82,76.4 7.82,77.56

### Text on the board
tNames: Switch | 40-Channel DAC Control Board v2 | 3.3V | 5V | 12V | POWER | Designed by Gao Linkun | On | Off | SS_DAC | MOSI | MISO | SCLK | 12V | 1 | 2 | 3 | 4 | 5 | 6 | 7 | 8 | 12V | 9 | 10 | 11 | 12 | 13 | 14 | 15 | 16 | 12V | 17 | 18 | 19 | 20 | 21 | 22 | 23 | 24 | 12V | 25 | 26 | 27 | 28 | 29 | 30 | 31 | 32 | 12V | 33 | 34 | 35 | 36 | 37 | 38 | 39 | 40